# EasyEDA Pro project 慢上掉电自动化_2.eprj, schematic Schematic1

## Sheets
1 CTRL_MCU: Create Date: 2023-10-24; Page Name: CTRL_MCU; Project Name: 慢上掉电自动化_2; Schematic Name: Schematic1; Update Date: 2023-10-26; Company: 嘉立创EDA; Page Size: A4; Version: V1.0
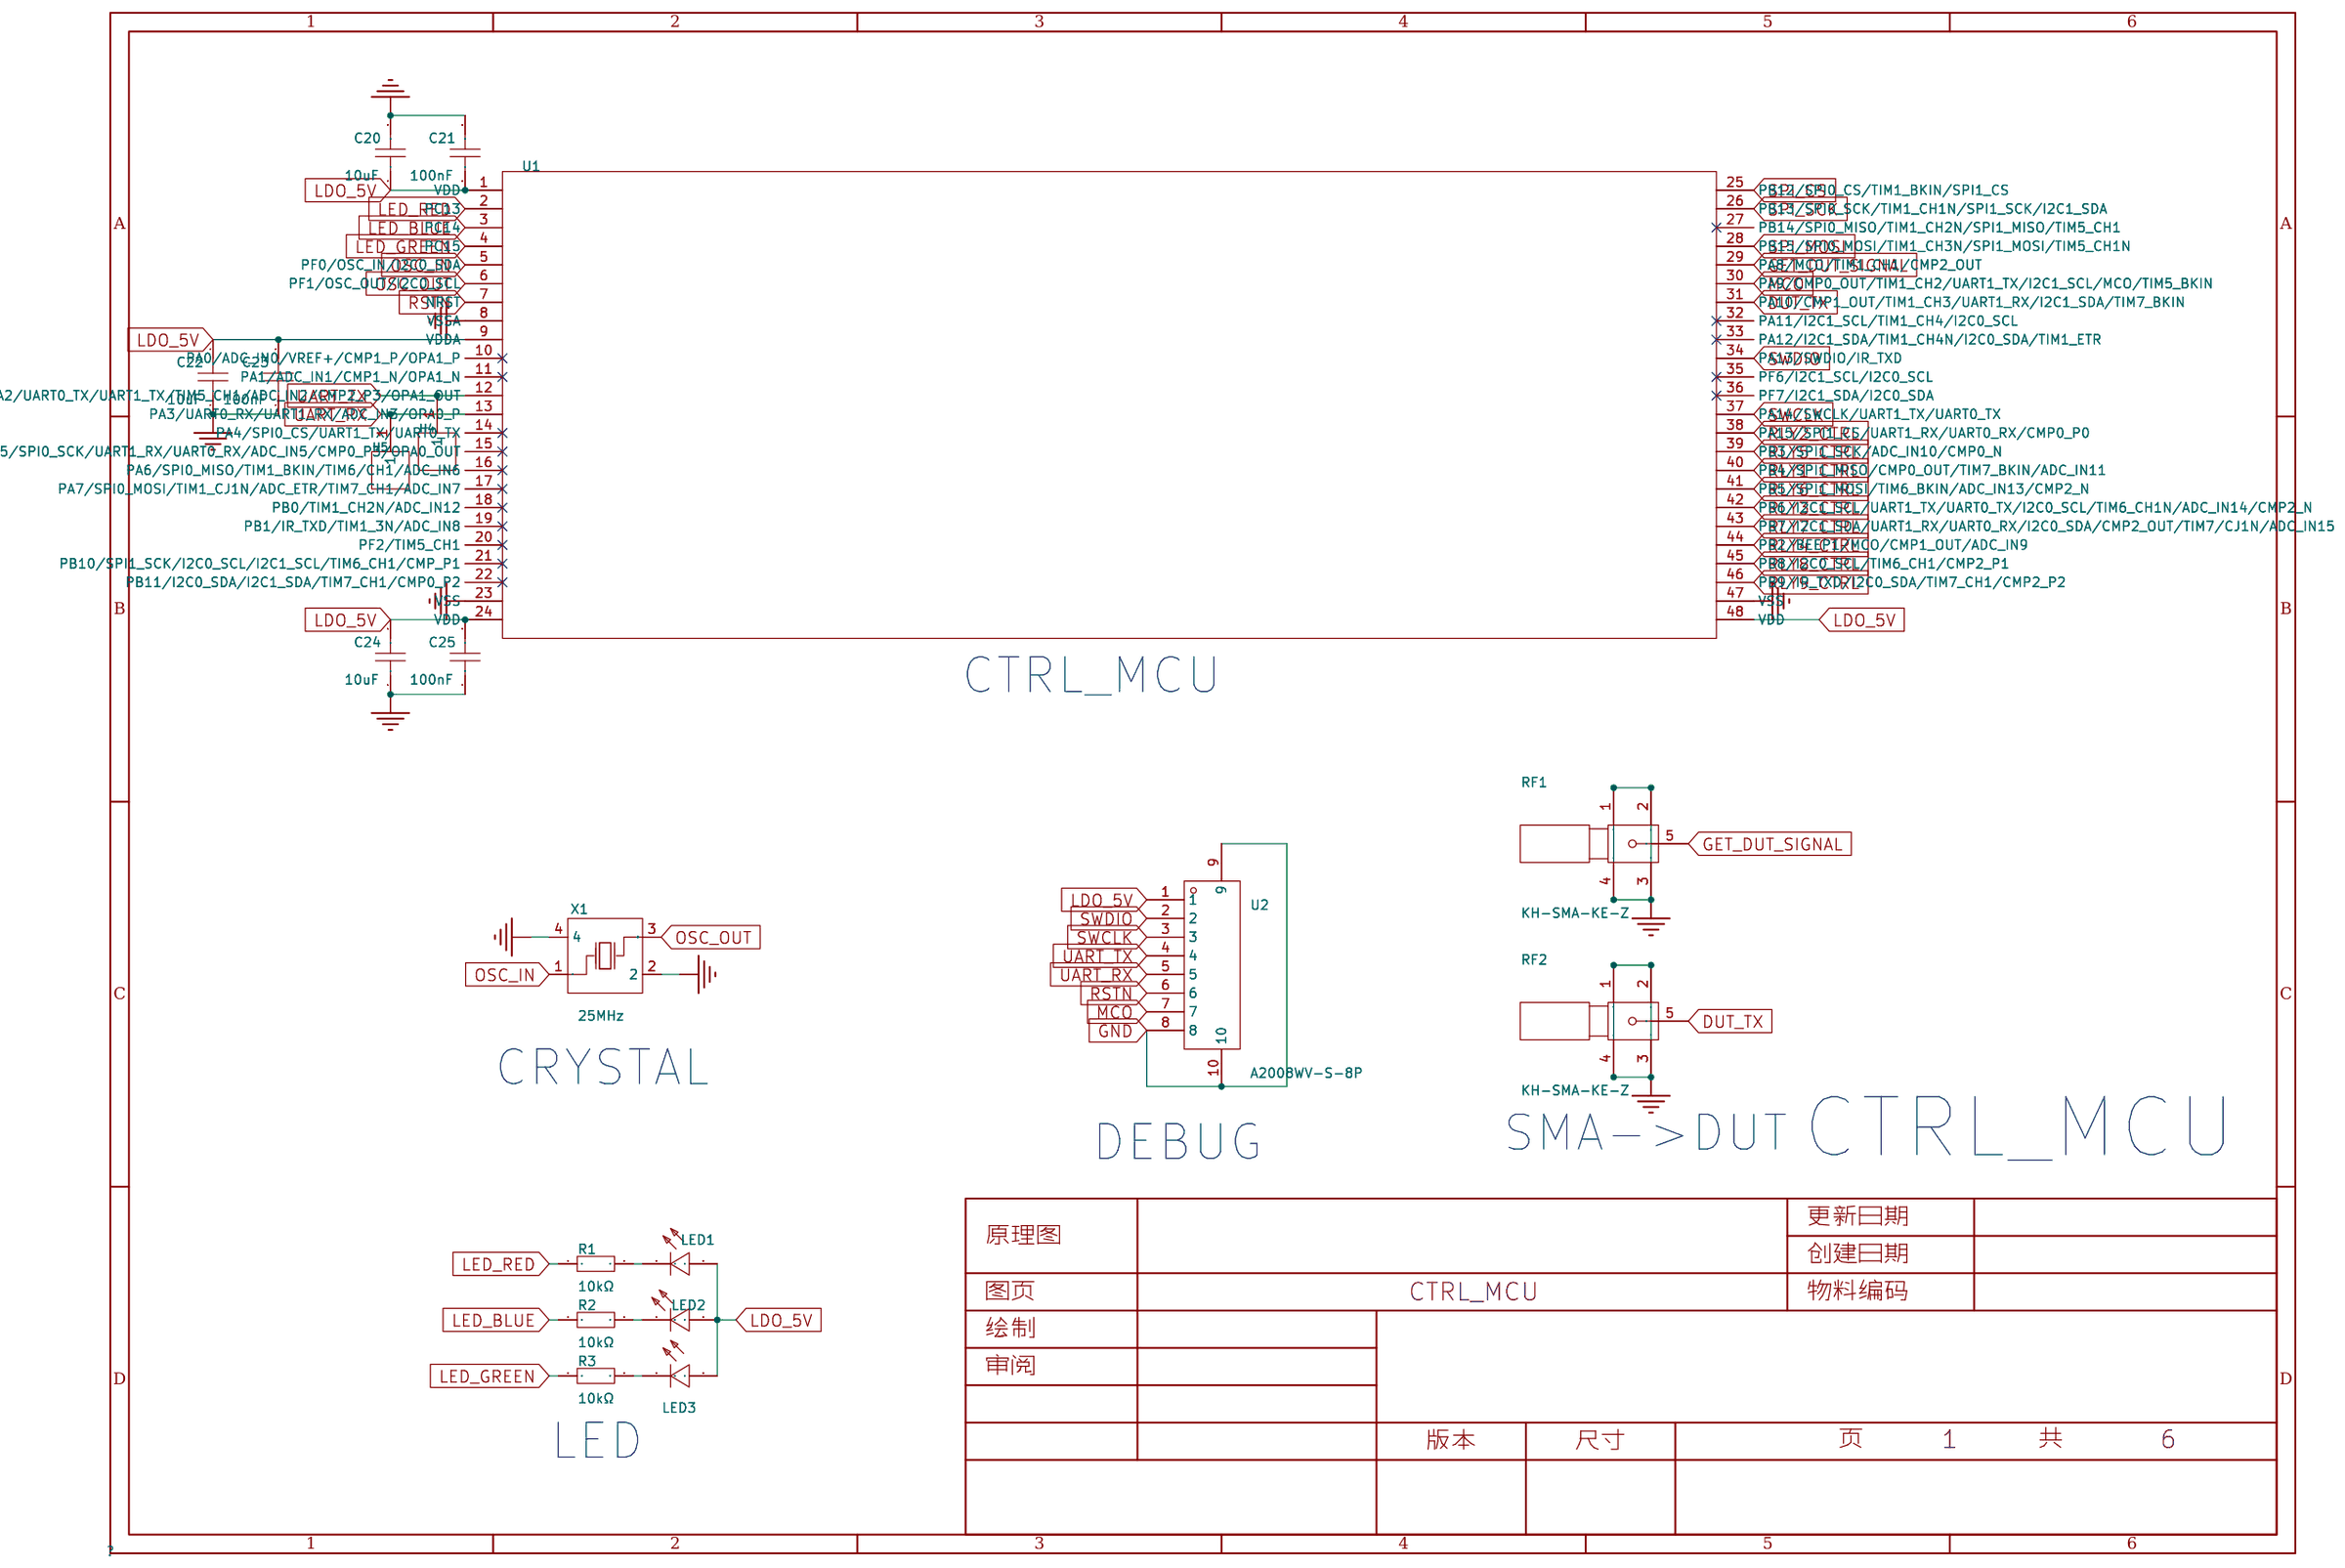
[diagram p0: CTRL_MCU]
2 POWER: Page Name: POWER; Update Date: 2023-10-25
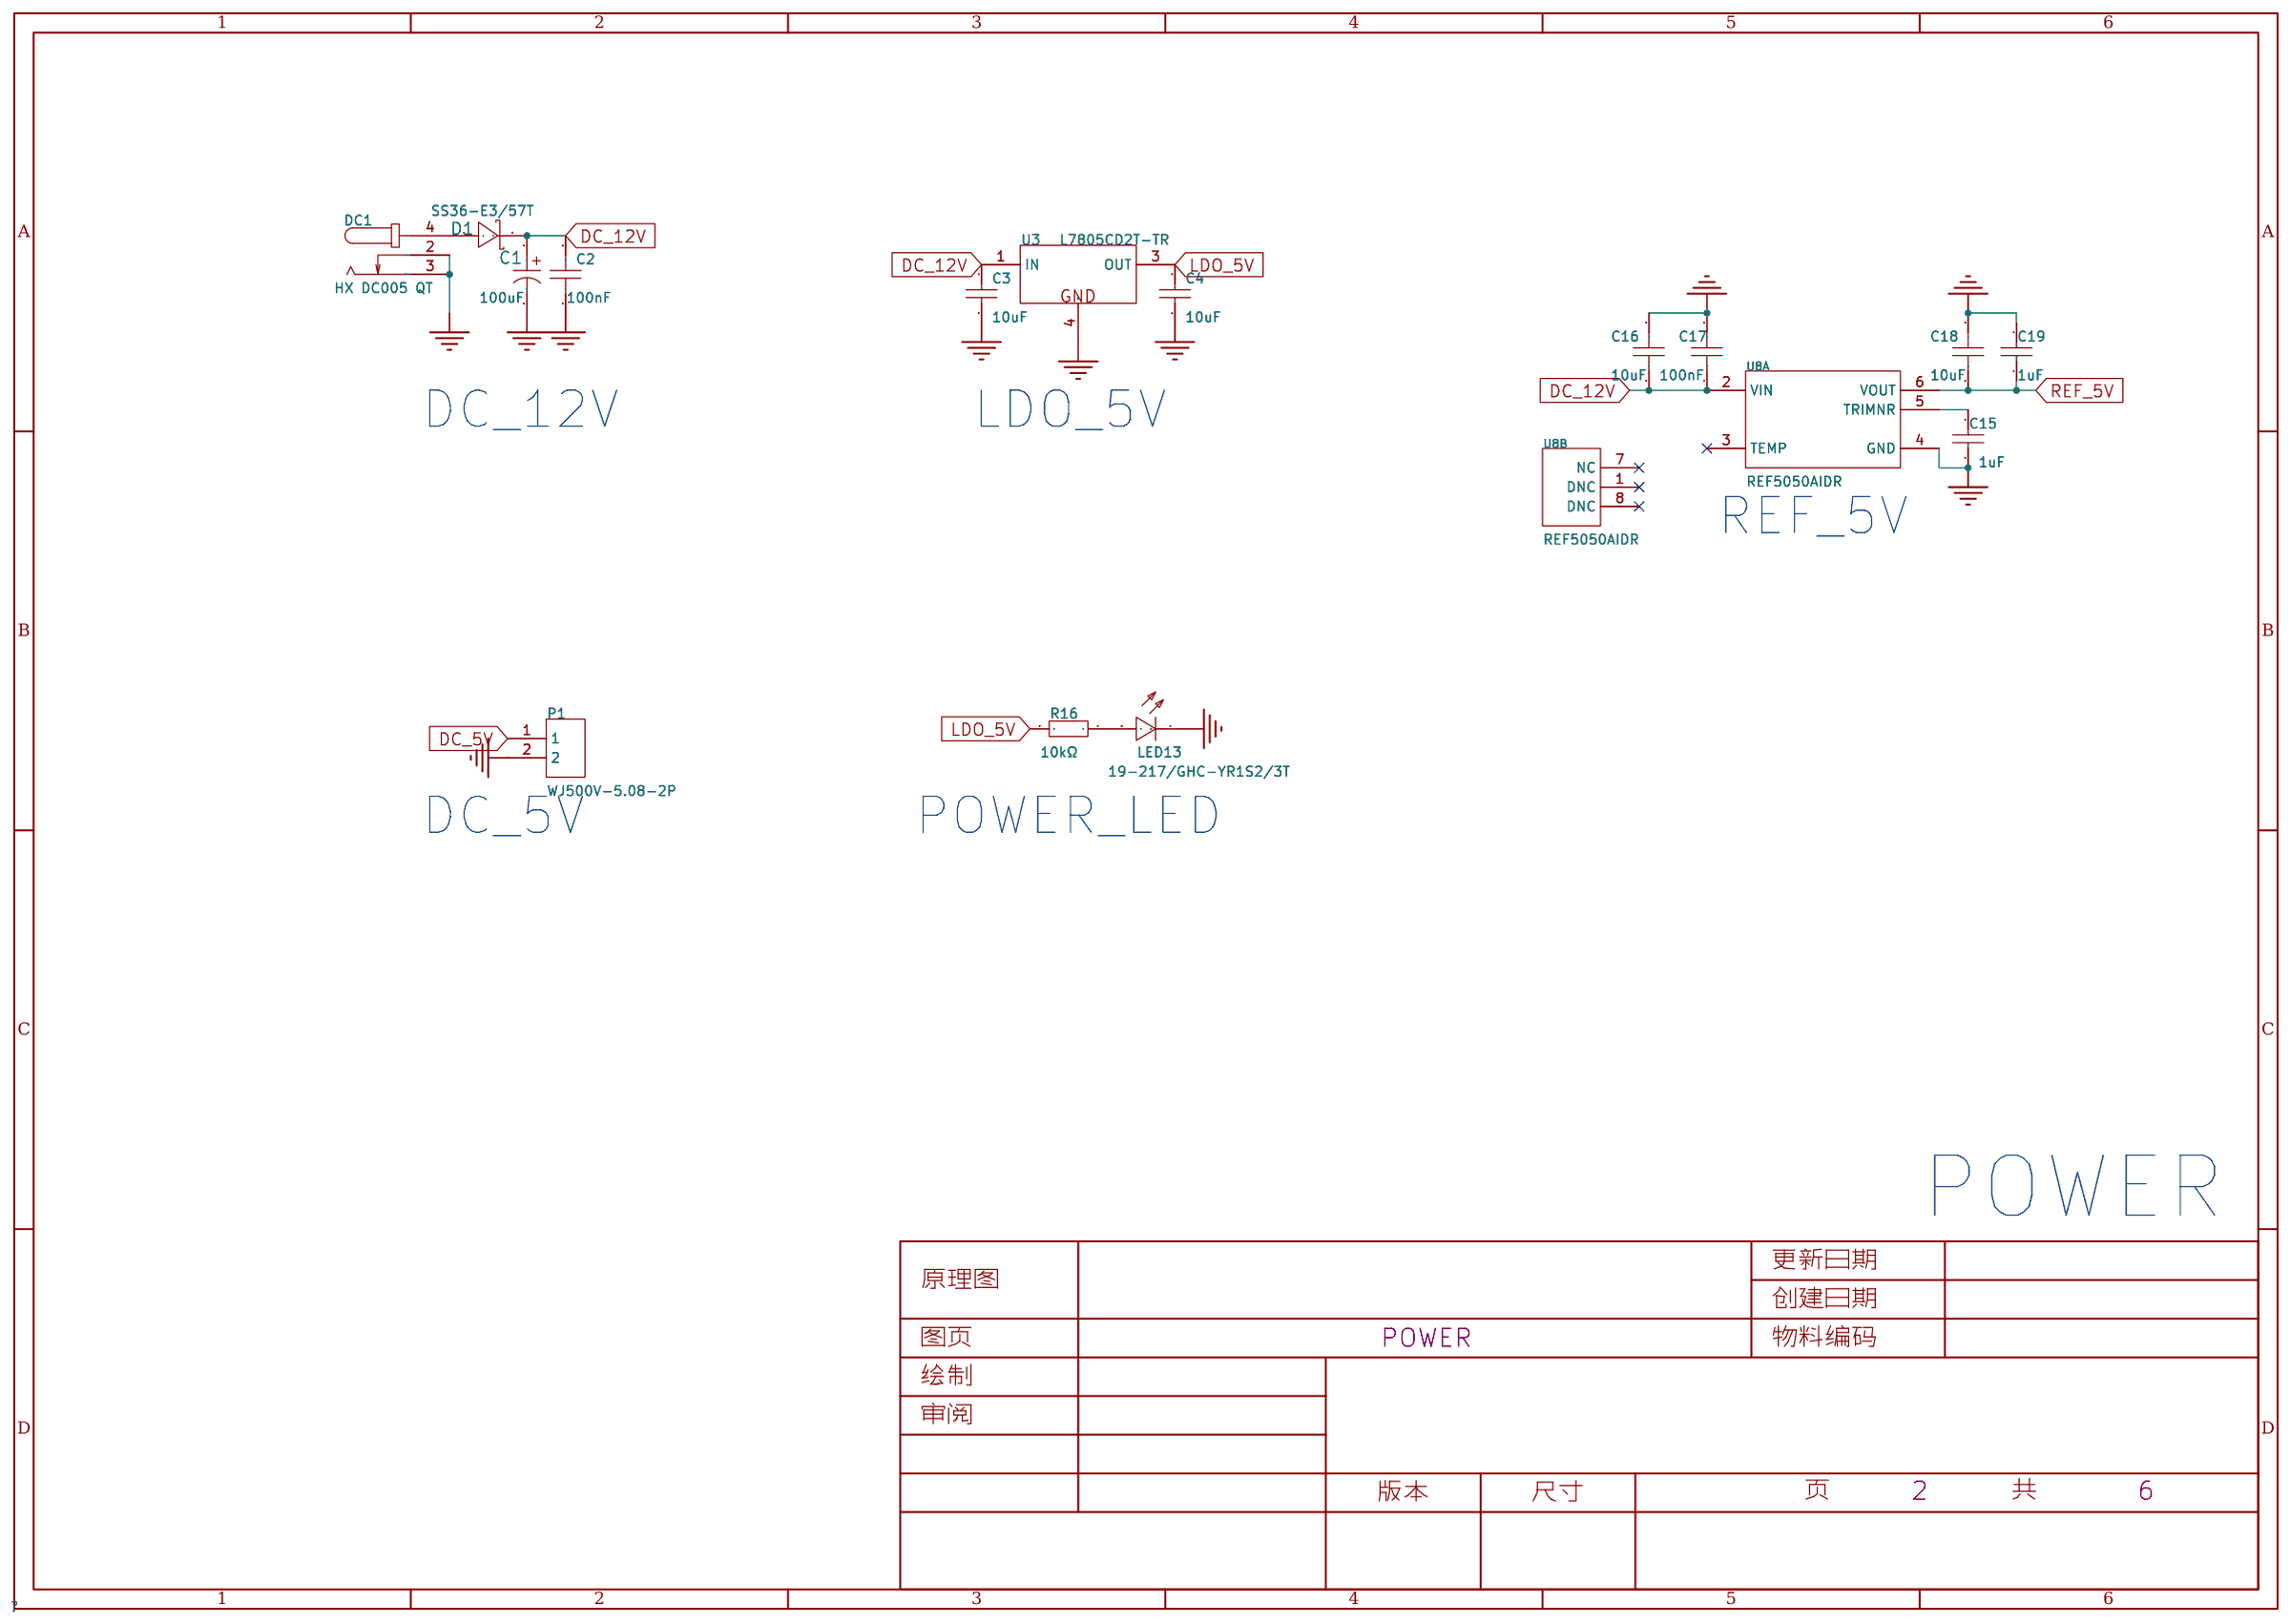
[diagram p1: POWER]
3 UART: Page Name: UART; Update Date: 2023-10-24
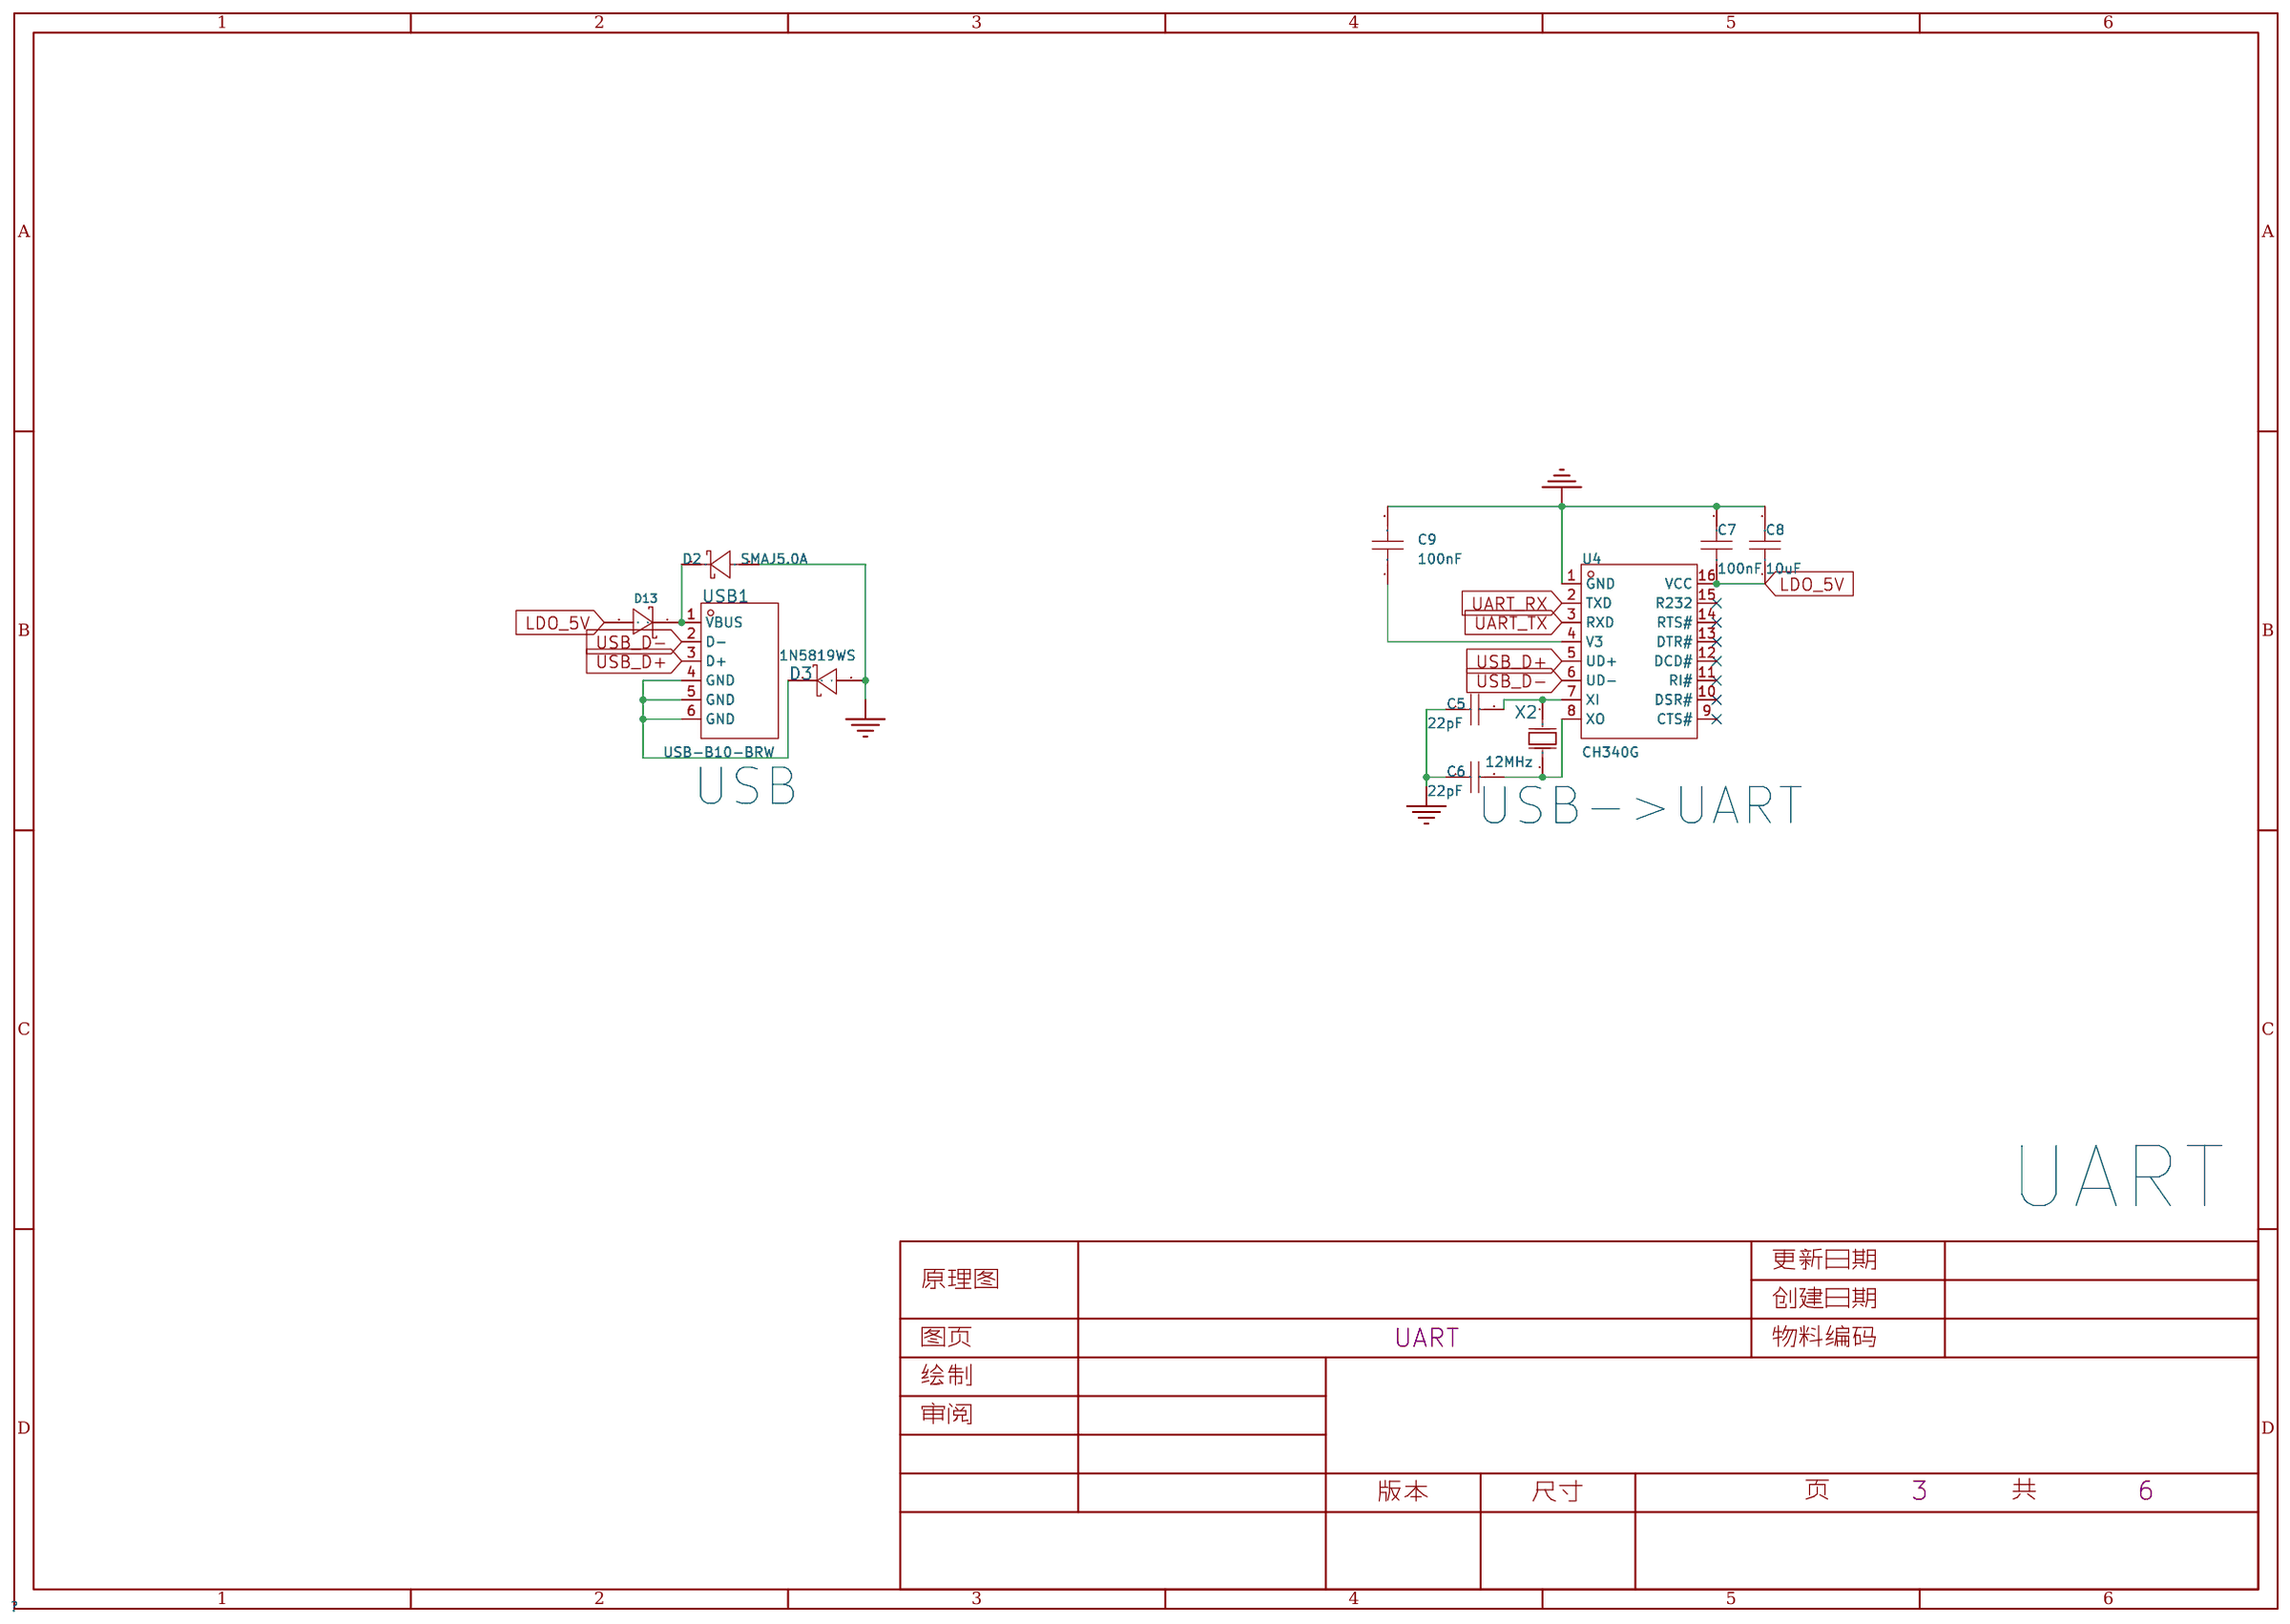
[diagram p2: UART]
4 螺孔: Page Name: 螺孔; Update Date: 2023-10-24
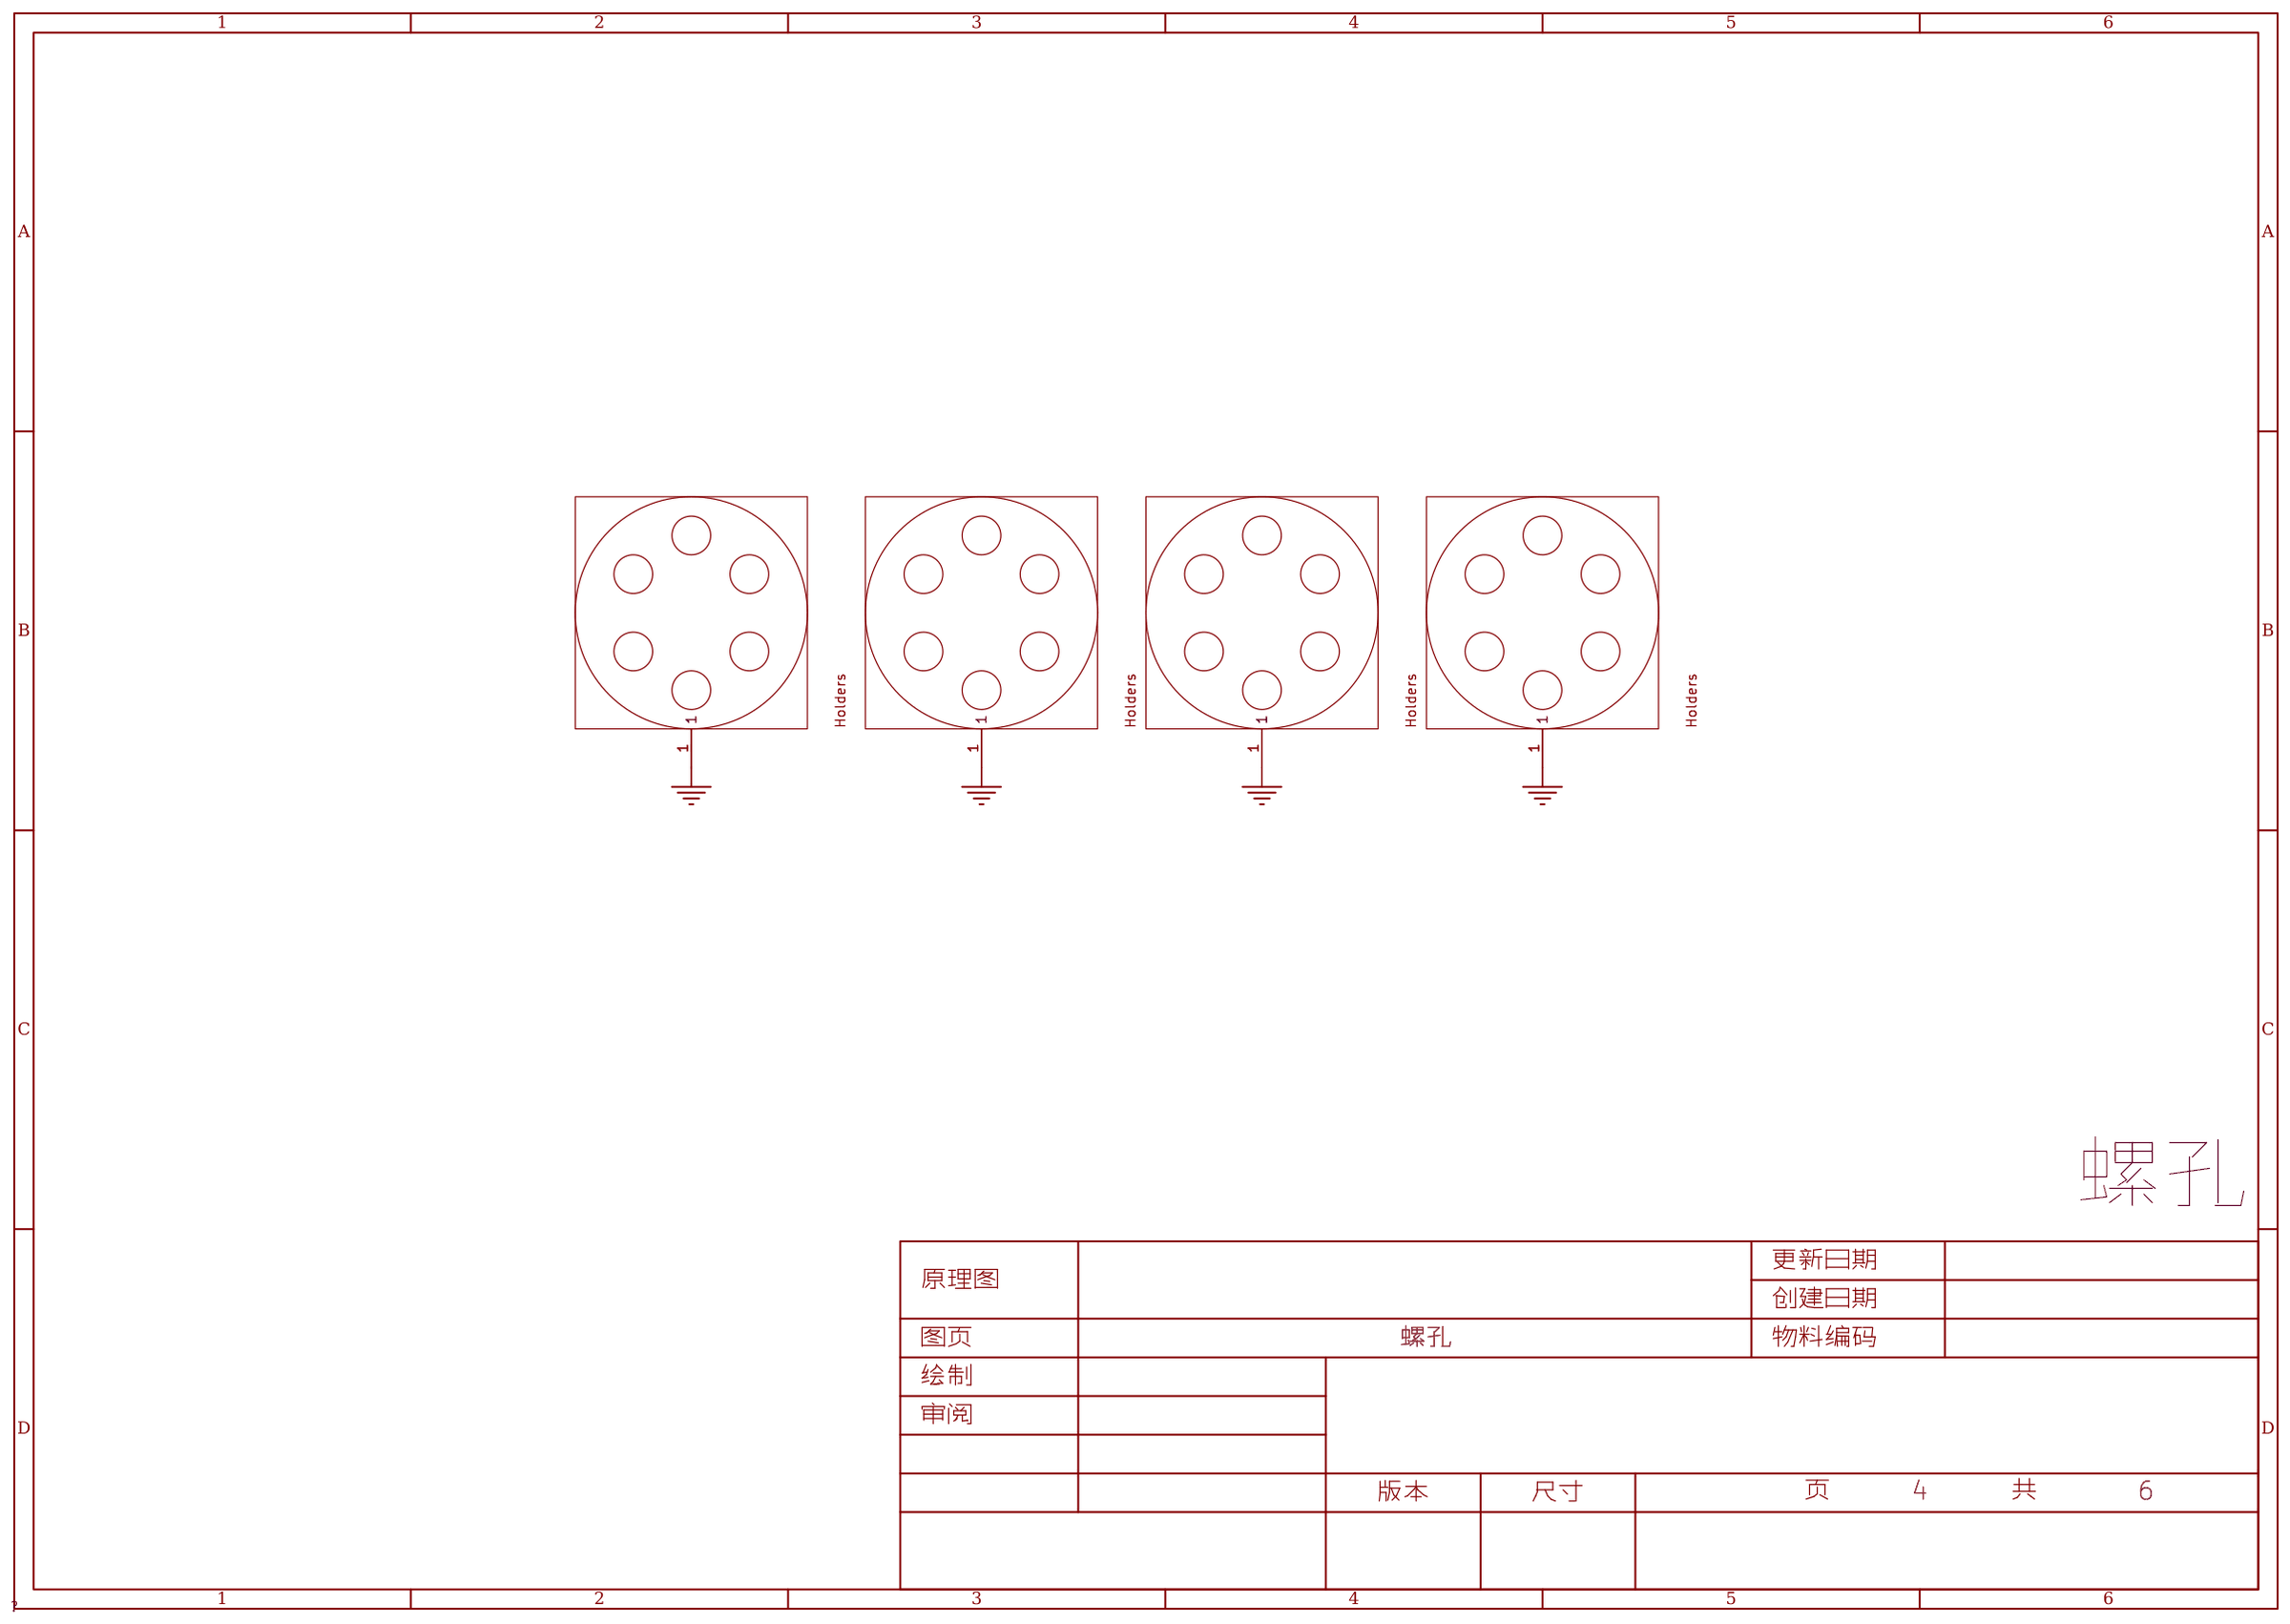
[diagram p3: 螺孔]
5 DAC: Page Name: DAC; Update Date: 2023-10-25
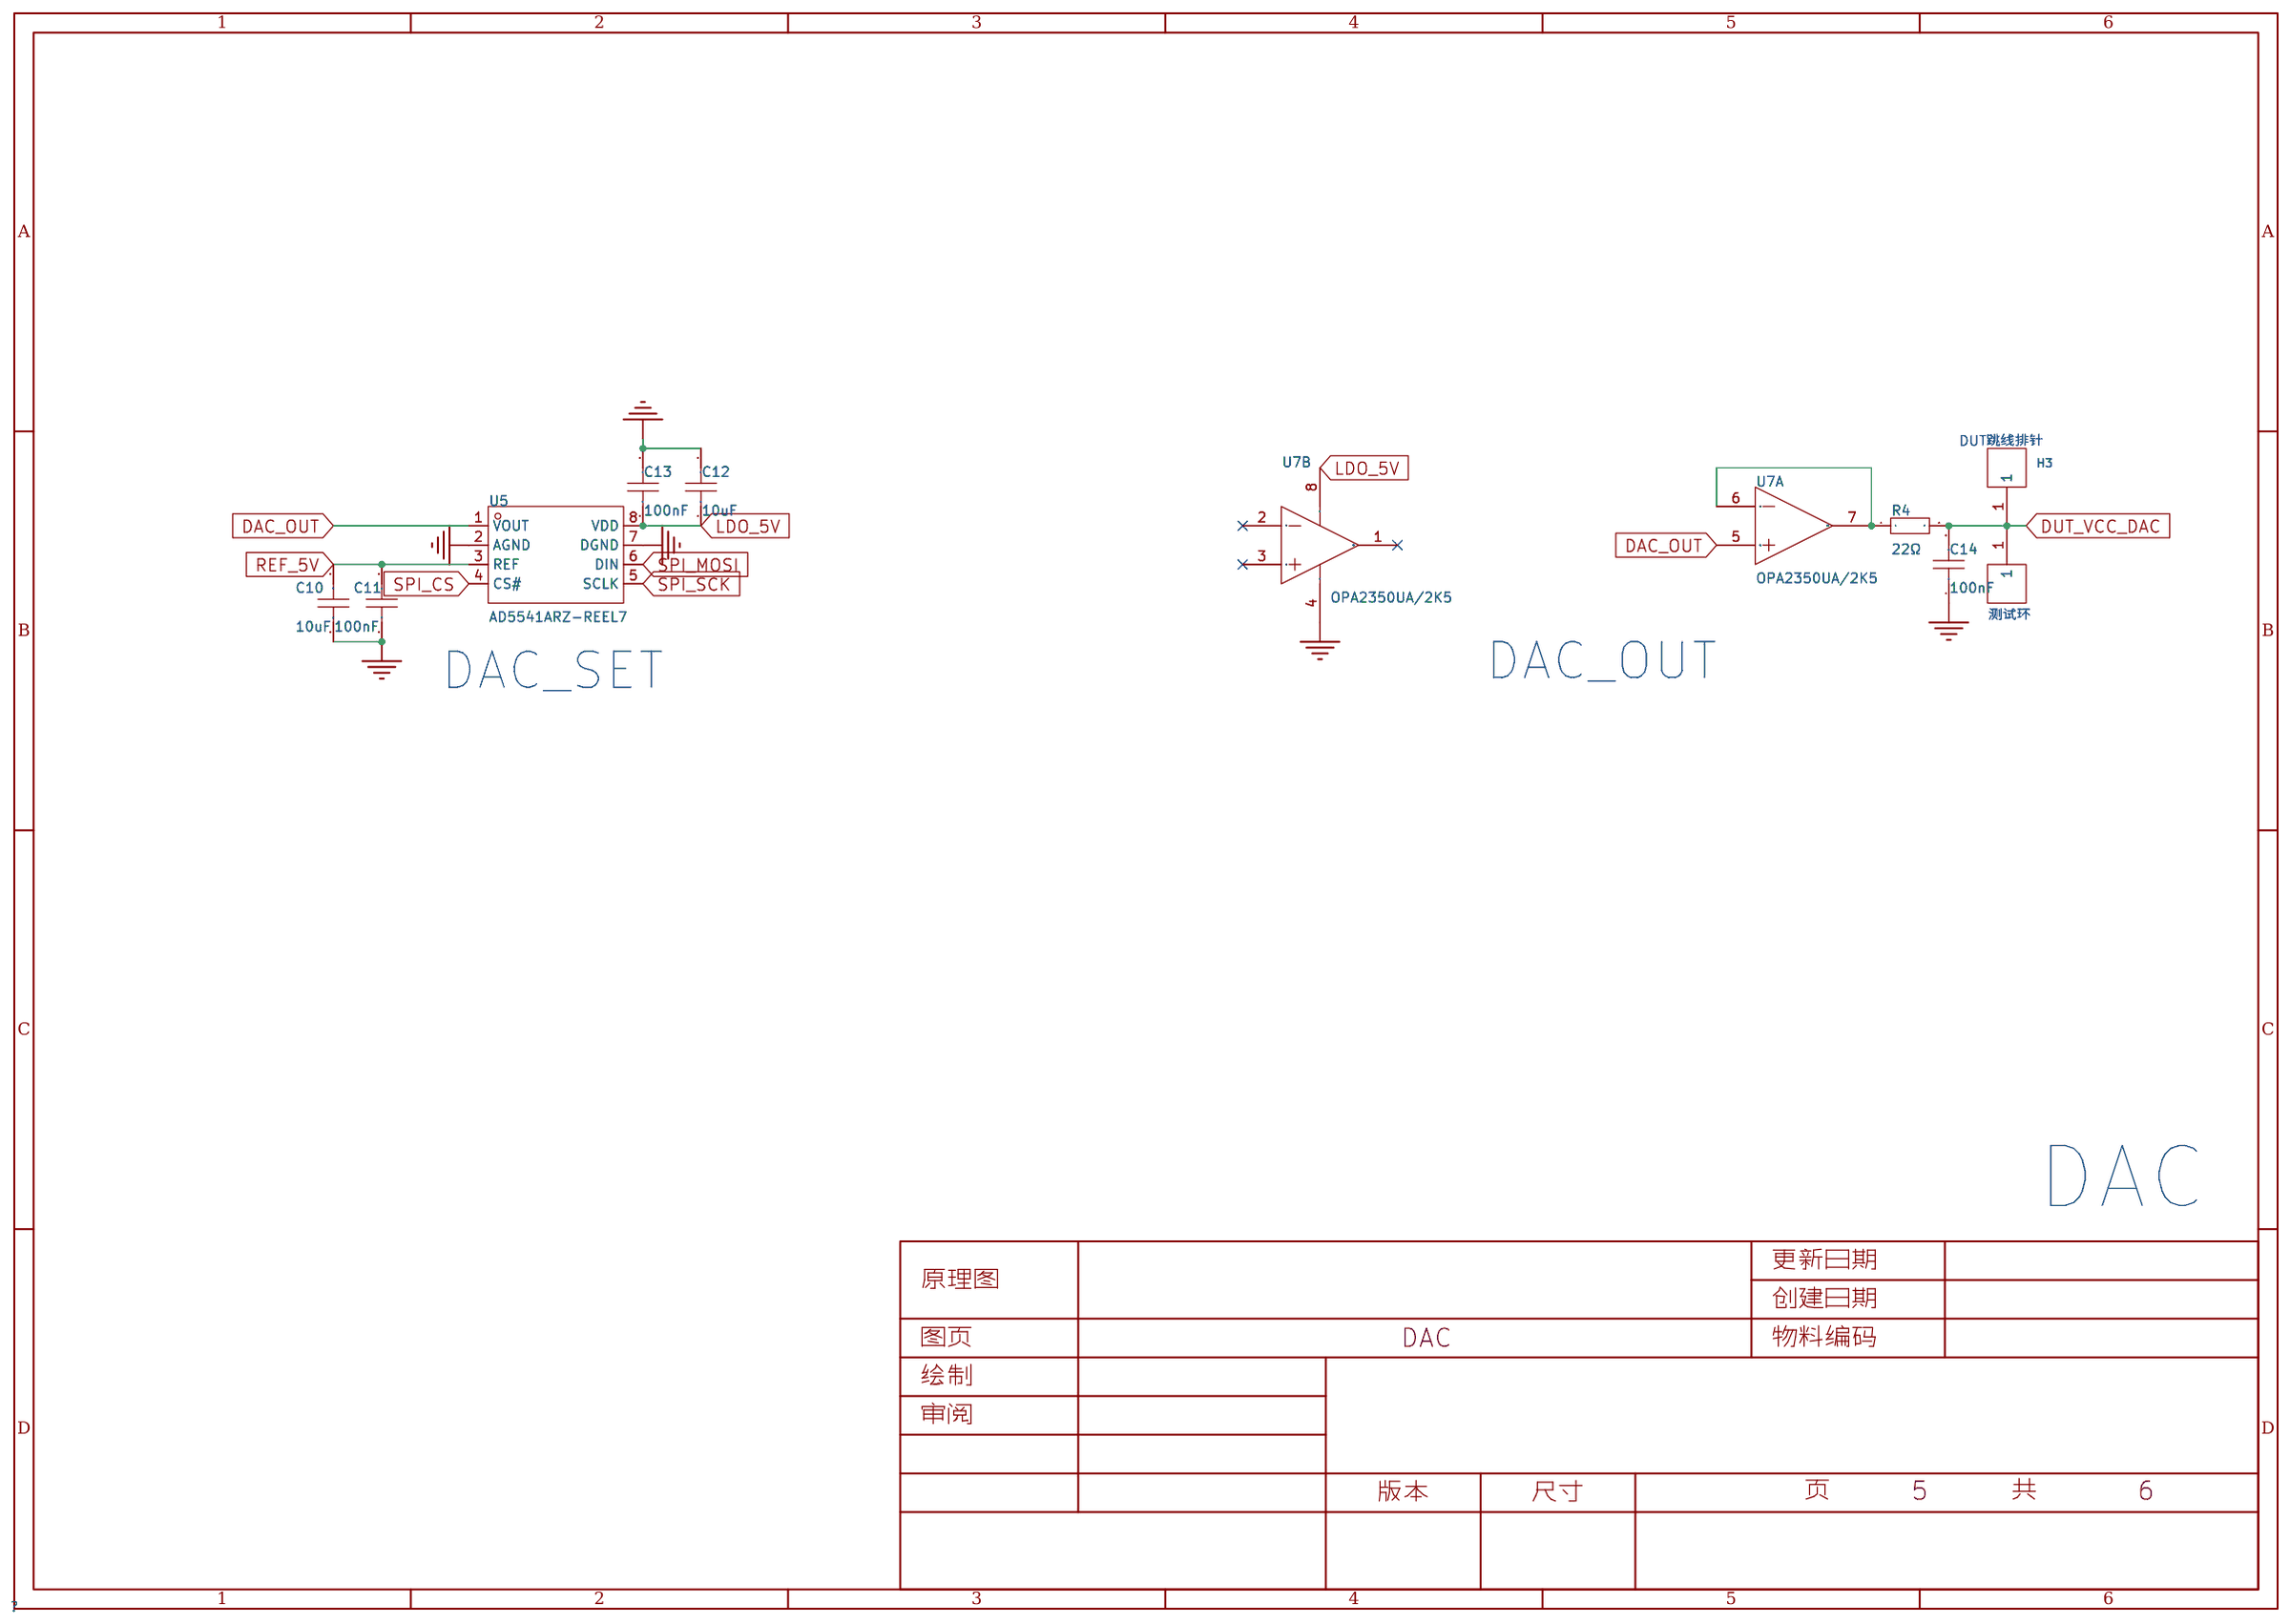
[diagram p4: DAC]
6 RLY: Page Name: RLY; Update Date: 2023-10-25
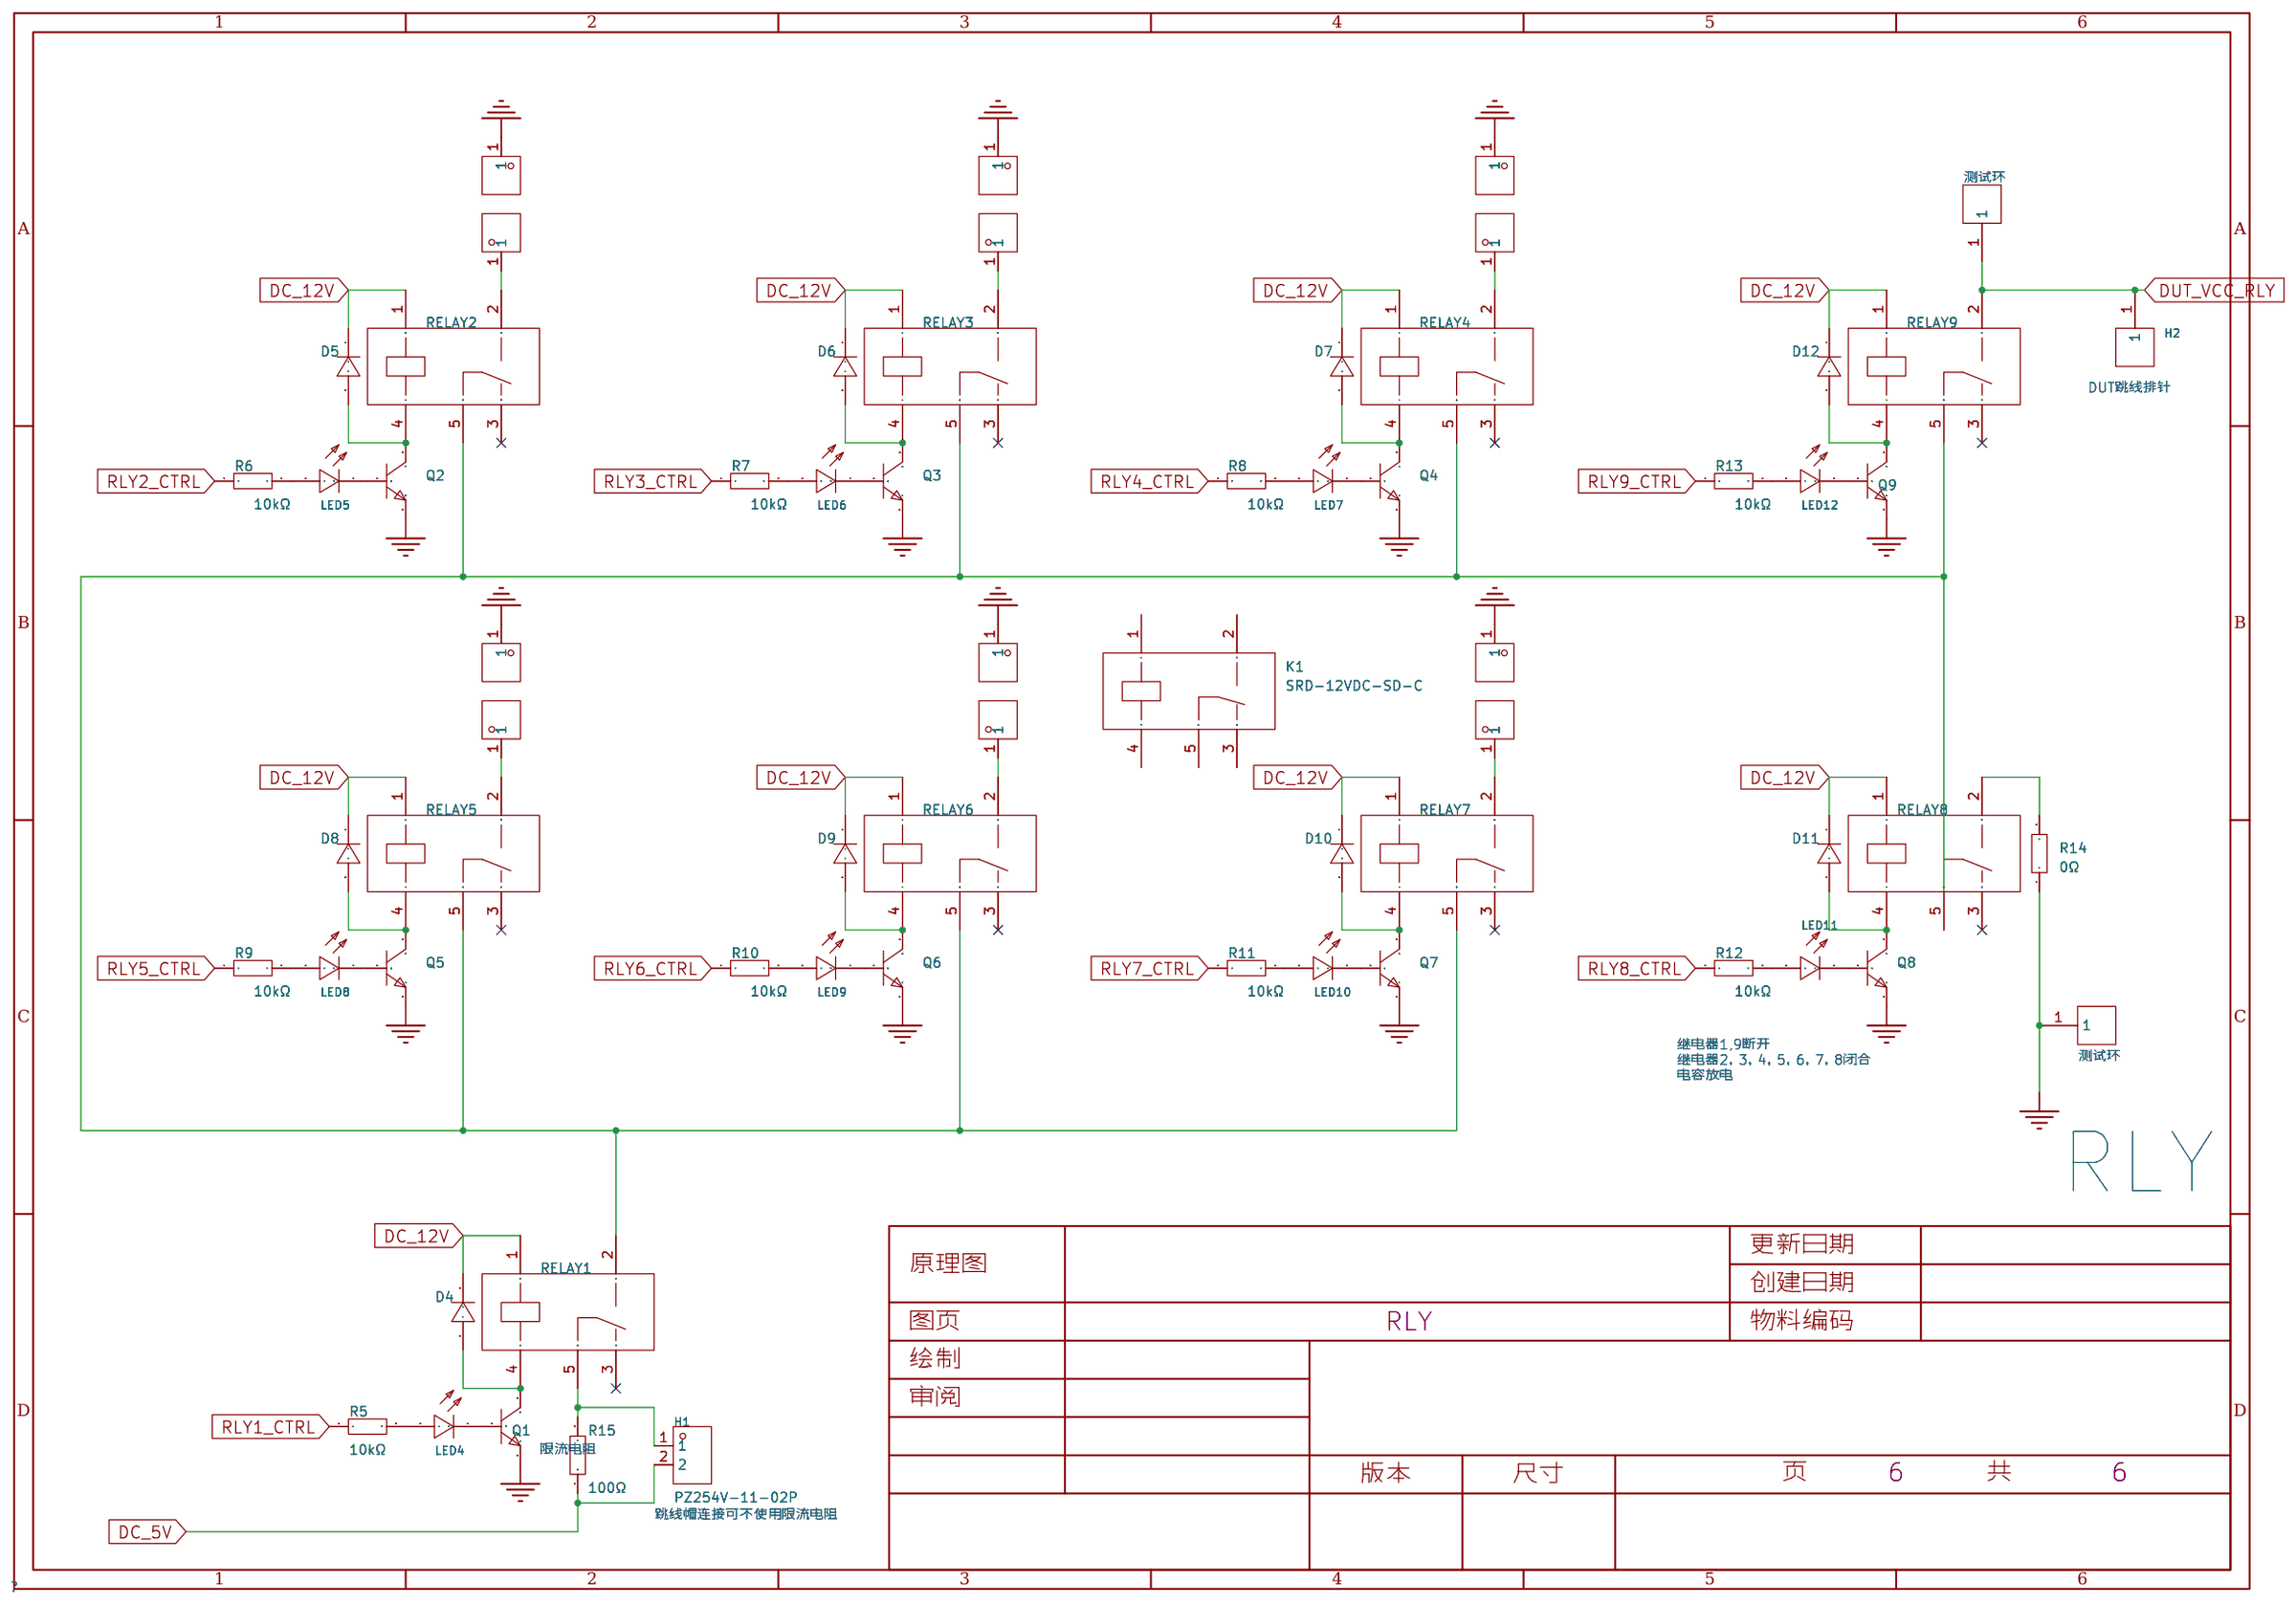
[diagram p5: RLY]

## Parts
sheet CTRL_MCU
C20  10uF  [C0603]
C21  100nF  [C0603]
C22  10uF  [C0603]
C23  100nF  [C0603]
C24  10uF  [C0603]
C25  100nF  [C0603]
H4  PZ254V-11-01P  [HDR-TH_1P-P2.54-V-M]
H5  PZ254V-11-01P  [HDR-TH_1P-P2.54-V-M]
LED1  NCD0603R1  [LED0603-RD_RED]
LED2  19-217/BHC-ZL1M2RY/3T  [LED0603-FD_BLUE]
LED3  19-217/GHC-YR1S2/3T  [LED0603-RD]
R1  10kΩ  [R0603]
R2  10kΩ  [R0603]
R3  10kΩ  [R0603]
RF1  KH-SMA-KE-Z  [SMA-TH_KH-SMA-KE-Z]
RF2  KH-SMA-KE-Z  [SMA-TH_KH-SMA-KE-Z]
U1  PT32A030C8T7  [LQFP-48_7.0X7.0X0.5P]
U2  A2008WV-S-8P  [CONN-SMD_A2008WV-S-8P]
X1  25MHz  [OSC-SMD_4P-L2.5-W2.0-BL]
sheet DAC
C10  10uF  [C0603]
C11  100nF  [C0603]
C12  10uF  [C0603]
C13  100nF  [C0603]
C14  100nF  [C0603]
H3  PZ254V-11-01P  [HDR-TH_1P-P2.54-V-M]
R4  22Ω  [R0603]
U5  AD5541ARZ-REEL7  [SOIC-8_L5.0-W4.0-P1.27-LS6.0-BL]
U7  OPA2350UA/2K5  [SOIC-8_L4.9-W3.9-P1.27-LS6.0-BL]  (sections 1,2)
U40  RH-5000  [TEST-TH_BD2.54-P1.4_RED]
sheet POWER
C1  100uF  [CAP-SMD_BD6.3-L6.6-W6.6-LS7.6-FD-1]
C2  100nF  [C0603]
C3  10uF  [C1206]
C4  10uF  [C1206]
C15  1uF  [C0603]
C16  10uF  [C0603]
C17  100nF  [C0603]
C18  10uF  [C0603]
C19  1uF  [C0603]
D1  SS36-E3/57T  [SMC_L7.1-W6.2-LS8.1-R-RD]
DC1  HX DC005 QT  [DC-IN-TH_HANXIA_HX-DC005-QT]
LED13  19-217/GHC-YR1S2/3T  [LED0603-RD]
P1  WJ500V-5.08-2P  [CONN-TH_2P-P5.00_WJ500V-5.08-2P]
R16  10kΩ  [R0603]
U3  L7805CD2T-TR  [TO-263-2_L10.0-W9.1-P5.08-LS15.2-TL]
U8  REF5050AIDR  [SOIC-8_L5.0-W4.0-P1.27-LS6.0-BL]  (sections 1,2)
sheet RLY
D4  1N4148WS  [SOD-323_L1.8-W1.3-LS2.5-RD]
D5  1N4148WS  [SOD-323_L1.8-W1.3-LS2.5-RD]
D6  1N4148WS  [SOD-323_L1.8-W1.3-LS2.5-RD]
D7  1N4148WS  [SOD-323_L1.8-W1.3-LS2.5-RD]
D8  1N4148WS  [SOD-323_L1.8-W1.3-LS2.5-RD]
D9  1N4148WS  [SOD-323_L1.8-W1.3-LS2.5-RD]
D10  1N4148WS  [SOD-323_L1.8-W1.3-LS2.5-RD]
D11  1N4148WS  [SOD-323_L1.8-W1.3-LS2.5-RD]
D12  1N4148WS  [SOD-323_L1.8-W1.3-LS2.5-RD]
H1  PZ254V-11-02P  [HDR-TH_2P-P2.54-V-M]
H2  PZ254V-11-01P  [HDR-TH_1P-P2.54-V-M]
K1  SRD-12VDC-SD-C  [RELAY-TH_SRD-XXVDC-SD-C]
LED4  19-217/GHC-YR1S2/3T  [LED0603-RD]
LED5  19-217/GHC-YR1S2/3T  [LED0603-RD]
LED6  19-217/GHC-YR1S2/3T  [LED0603-RD]
LED7  19-217/GHC-YR1S2/3T  [LED0603-RD]
LED8  19-217/GHC-YR1S2/3T  [LED0603-RD]
LED9  19-217/GHC-YR1S2/3T  [LED0603-RD]
LED10  19-217/GHC-YR1S2/3T  [LED0603-RD]
LED11  19-217/GHC-YR1S2/3T  [LED0603-RD]
LED12  19-217/GHC-YR1S2/3T  [LED0603-RD]
Q1  SS8050  [SOT-23-3_L2.9-W1.3-P1.90-LS2.4-BR]
Q2  SS8050  [SOT-23-3_L2.9-W1.3-P1.90-LS2.4-BR]
Q3  SS8050  [SOT-23-3_L2.9-W1.3-P1.90-LS2.4-BR]
Q4  SS8050  [SOT-23-3_L2.9-W1.3-P1.90-LS2.4-BR]
Q5  SS8050  [SOT-23-3_L2.9-W1.3-P1.90-LS2.4-BR]
Q6  SS8050  [SOT-23-3_L2.9-W1.3-P1.90-LS2.4-BR]
Q7  SS8050  [SOT-23-3_L2.9-W1.3-P1.90-LS2.4-BR]
Q8  SS8050  [SOT-23-3_L2.9-W1.3-P1.90-LS2.4-BR]
Q9  SS8050  [SOT-23-3_L2.9-W1.3-P1.90-LS2.4-BR]
R5  10kΩ  [R0603]
R6  10kΩ  [R0603]
R7  10kΩ  [R0603]
R8  10kΩ  [R0603]
R9  10kΩ  [R0603]
R10  10kΩ  [R0603]
R11  10kΩ  [R0603]
R12  10kΩ  [R0603]
R13  10kΩ  [R0603]
R14  0Ω  [R0603]
R15  100Ω  [R0603]
RELAY1  SRD-12VDC-SL-C  [RELAY-TH_SRD-XXVDC-XL-C]
RELAY2  SRD-12VDC-SL-C  [RELAY-TH_SRD-XXVDC-XL-C]
RELAY3  SRD-12VDC-SL-C  [RELAY-TH_SRD-XXVDC-XL-C]
RELAY4  SRD-12VDC-SL-C  [RELAY-TH_SRD-XXVDC-XL-C]
RELAY5  SRD-12VDC-SL-C  [RELAY-TH_SRD-XXVDC-XL-C]
RELAY6  SRD-12VDC-SL-C  [RELAY-TH_SRD-XXVDC-XL-C]
RELAY7  SRD-12VDC-SL-C  [RELAY-TH_SRD-XXVDC-XL-C]
RELAY8  SRD-12VDC-SL-C  [RELAY-TH_SRD-XXVDC-XL-C]
RELAY9  SRD-12VDC-SL-C  [RELAY-TH_SRD-XXVDC-XL-C]
U21  X5511FV-01-C30D97-0970  [HDR-TH_1P-V-F-1]
U27  X5511FV-01-C30D97-0970  [HDR-TH_1P-V-F-1]
U28  X5511FV-01-C30D97-0970  [HDR-TH_1P-V-F-1]
U29  X5511FV-01-C30D97-0970  [HDR-TH_1P-V-F-1]
U30  X5511FV-01-C30D97-0970  [HDR-TH_1P-V-F-1]
U31  X5511FV-01-C30D97-0970  [HDR-TH_1P-V-F-1]
U32  X5511FV-01-C30D97-0970  [HDR-TH_1P-V-F-1]
U33  X5511FV-01-C30D97-0970  [HDR-TH_1P-V-F-1]
U34  X5511FV-01-C30D97-0970  [HDR-TH_1P-V-F-1]
U35  X5511FV-01-C30D97-0970  [HDR-TH_1P-V-F-1]
U36  X5511FV-01-C30D97-0970  [HDR-TH_1P-V-F-1]
U37  X5511FV-01-C30D97-0970  [HDR-TH_1P-V-F-1]
U38  RH-5000  [TEST-TH_BD2.54-P1.4_RED]
U39  RH-5000  [TEST-TH_BD2.54-P1.4_RED]
sheet UART
C5  22pF  [C0603]
C6  22pF  [C0603]
C7  100nF  [C0603]
C8  10uF  [C0603]
C9  100nF  [C0603]
D2  SMAJ5.0A  [SMA_L4.3-W2.6-LS5.0-RD]
D3  1N5819WS  [SOD-323_L1.8-W1.3-LS2.5-RD]
D13  1N5819WS  [SOD-323_L1.8-W1.3-LS2.5-RD]
U4  CH340G  [SOIC-16_L9.9-W3.9-P1.27-LS6.0-BL]
USB1  USB-B10-BRW  [USB-B-TH_USB-B10-BRW]
X2  12MHz  [HC-49US_L11.5-W4.5-P4.88]
sheet 螺孔
J2  -  [DEMO板安装孔]
J3  -  [DEMO板安装孔]
J4  -  [DEMO板安装孔]
J5  -  [DEMO板安装孔]

## Library data of the parts
C10 C12 C16 C18 C20 C22 C24 = CL10A106MA8NRNC: 容值:10uF;精度:±20%;额定电压:25V;材质(温度系数):X5R;; LCSC Part Name: 10uF ±20% 25V; Supplier Part: C96446; Manufacturer: SAMSUNG(三星); Supplier Footprint: 0603; JLCPCB Part Class: Basic Part; Datasheet: https://atta.szlcsc.com/upload/public/pdf/source/20170325/1490427913016.pdf; Supplier: LCSC; Tolerance: ±20%; Voltage Rated: 25V; Temperature Coefficient: X5R
C7 C9 C11 C13 C14 C17 C21 C23 C25 = CC0603KRX7R9BB104: 容值:100nF;精度:±10%;额定电压:50V;材质(温度系数):X7R;; LCSC Part Name: 100nF ±10% 50V; Supplier Part: C14663; Manufacturer: YAGEO(国巨); Supplier Footprint: 0603; JLCPCB Part Class: Basic Part; Datasheet: https://atta.szlcsc.com/upload/public/pdf/source/20180910/C282072_33301C7F631E79921B82A8DAC6BCC5B3.pdf; Supplier: LCSC; Tolerance: ±10%; Voltage Rated: 50V; Temperature Coefficient: X7R
H2-H5 = PZ254V-11-01P: 排数:单排;总PIN位数:1P;间距:2.54mm;插针结构:1x1P;行距:-;安装类型:直插;圆针/方针:方针;额定电流:-;额定电压:-;配合针长度:6mm;塑高:2.5mm;端接针长度:3mm;触头材质:黄铜;触头镀层:-;工作温度范围:-40℃~+105℃;颜色:黑色;; LCSC Part Name: 2.54mm 1x1P 直插 方针; Supplier Part: C492400; Manufacturer: XFCN(兴飞); Supplier Footprint: 插件,P=2.54mm; JLCPCB Part Class: Extended Part; Datasheet: https://atta.szlcsc.com/upload/public/pdf/source/20200309/C492400_46876A5B545F5AE6B8D4A09C46E276E8.pdf; Supplier: LCSC; Number of Rows: 单排; Number of Pins: 1P; Pitch: 2.54mm; Pin Structure: 1x1P; Mounting Type: 直插; Circluar Pins/Square Pins: 方针; Length of Mating Pin: 6mm; Insulation Height: 2.5mm; Length of End Connection Pin: 3mm; Contact Material: 黄铜; Operating Temperature Range: -40℃~+105℃; Color: 黑色
LED1 = NCD0603R1_C84263: 发光颜色:红灯;; LCSC Part Name: 红灯; Supplier Part: C84263; Manufacturer: 国星光电; Supplier Footprint: 0603; JLCPCB Part Class: Extended Part; Datasheet: https://atta.szlcsc.com/upload/public/pdf/source/20200820/C84263_DABC6A75E58F576973B407FDBA283D60.pdf; Supplier: LCSC; Emitted Color: 红灯
LED2 = 19-217/BHC-ZL1M2RY/3T: 发光颜色:蓝灯;二极管配置:-;主波长:465nm~475nm;色温:-;功率:110mW;安装方式:-;; LCSC Part Name: 蓝灯; Supplier Part: C72041; Manufacturer: EVERLIGHT(亿光); Supplier Footprint: 0603; JLCPCB Part Class: Basic Part; Datasheet: https://atta.szlcsc.com/upload/public/pdf/source/20170116/1484561237273.pdf; Supplier: LCSC; Emitted Color: 蓝灯; Lens Color: 无色透明; Dominant Wavelength: 465nm~475nm; Peak Wavelength: 468nm; Forward Current: 5mA; Power Dissipation: 110mW; Viewing Angle: 120°; Operating Temperature: -40℃~+85℃
LED3-LED13 = 19-217/GHC-YR1S2/3T: 发光颜色:翠绿;二极管配置:-;主波长:520nm~535nm;色温:-;功率:110mW;安装方式:-;; LCSC Part Name: 翠绿; Supplier Part: C72043; Manufacturer: EVERLIGHT(亿光); Supplier Footprint: 0603; JLCPCB Part Class: Basic Part; Datasheet: https://atta.szlcsc.com/upload/public/pdf/source/20160507/1462613613780.pdf; Supplier: LCSC; Emitted Color: 翠绿; Lens Color: 无色透明; Dominant Wavelength: 520nm~535nm; Peak Wavelength: 518nm; Forward Current: 20mA; Power Dissipation: 110mW; Viewing Angle: 120°; Operating Temperature: -40℃~+85℃
R1-R3 R5-R13 R16 = 0603WAF1002T5E: 电阻类型:厚膜电阻;阻值:10kΩ;精度:±1%;功率:100mW;; LCSC Part Name: 厚膜电阻 10kΩ ±1% 100mW; Supplier Part: C25804; Manufacturer: UNI-ROYAL(厚声); Supplier Footprint: 0603; JLCPCB Part Class: Basic Part; Datasheet: https://atta.szlcsc.com/upload/public/pdf/source/20200306/C422600_1E6D84923E4A46A82E41ADD87F860B5C.pdf; Supplier: LCSC; Type: 厚膜电阻; Tolerance: ±1%; Power(Watts): 100mW; Temperature Coefficient: ±100ppm/℃; Overload Voltage (Max): 75V; Operating Temperature Range: -55℃~+155℃
RF1 RF2 = KH-SMA-KE-Z: 连接器类型:板端;射频系列:SMA;接口类型:内孔;端口数量:1;阻抗:-;频率-最大值:-;样式:正脚;接口直径:6.2mm;接口长度/高度:8mm;工作温度范围:-;; LCSC Part Name: SMA镀金半牙板端直插座子,H=8MM; Supplier Part: C504007; Manufacturer: kinghelm(金航标); Supplier Footprint: 插件; JLCPCB Part Class: Extended Part; Datasheet: https://atta.szlcsc.com/upload/public/pdf/source/20200330/C504007_C31FA59B5EDC95FA4ACB3324B1A20151.pdf; Supplier: LCSC; Connector Type: 板端; RF Series: SMA; Interface Type: 内孔; Number of Ports: 1; Sytle: 正脚; Interface Diameter: 6.2mm; Interface Length/Height: 8mm
U1 = PT32A030C8T7
U2 = A2008WV-S-8P: 参考系列:PH;间距:2mm;插针结构:1x8P;排数:1;每排PIN数:8;行距:-;安装方式:-;触头材质:黄铜;; LCSC Part Name: PH 2mm 1x8P 镀锡; Supplier Part: C273128; Manufacturer: CJT(长江连接器); Supplier Footprint: SMD,P=2mm; JLCPCB Part Class: Extended Part; Datasheet: https://atta.szlcsc.com/upload/public/pdf/source/20180913/C273128_BB1852F7672CD820F7AD4E26555E7BEC.pdf; Supplier: LCSC; Reference Series: PH; Pitch: 2mm; Pins Structure: 1x8P; Number of Rows: 1; Number of PINs Per Row: 8; Contact Material: 黄铜
X1 = ECS-250-10-36Q-AES-TR: 晶振类型:-;频率:25MHz;频率公差:±25ppm;频率稳定度:±50ppm;负载电容:10pF;等效串联电阻(ESR):60Ω;工作温度:-40℃~+125℃;; LCSC Part Name: 25MHz ±25ppm 10pF; Supplier Part: C435199; Manufacturer: ECS; Supplier Footprint: SMD2520-4P; JLCPCB Part Class: Extended Part; Datasheet: https://atta.szlcsc.com/upload/public/pdf/source/20200102/C435199_2BF86DF6FEC67718933C4FC174F98801.pdf; Supplier: LCSC; Frequency Tolerance: ±25ppm; Frequency Stability: ±50ppm; Load Capacitance: 10pF; Equivalent Series Resistance (ESR): 60Ω; Operating Temperature: -40℃~+125℃
R4 = 0603WAF220JT5E: 电阻类型:厚膜电阻;阻值:22Ω;精度:±1%;功率:100mW;; LCSC Part Name: 22Ω ±1% 100mW; Supplier Part: C23345; Manufacturer: UNI-ROYAL(厚声); Supplier Footprint: 0603; JLCPCB Part Class: Basic Part; Datasheet: https://atta.szlcsc.com/upload/public/pdf/source/20200306/C422600_1E6D84923E4A46A82E41ADD87F860B5C.pdf; Supplier: LCSC; Type: 厚膜电阻; Tolerance: ±1%; Power(Watts): 100mW; Temperature Coefficient: ±100ppm/℃; Overload Voltage (Max): 75V; Operating Temperature Range: -55℃~+155℃
U5 = AD5541ARZ-REEL7: D/A 位数:-;D/A通道数:-;输出类型:-;读写接口类型:-;; Supplier Part: C967393; Manufacturer: ADI(亚德诺)/LINEAR; Supplier Footprint: SOIC-8; JLCPCB Part Class: Extended Part; Datasheet: https://atta.szlcsc.com/upload/public/pdf/source/20200720/C649795_5D512B206C8637CEAE7C18B6DAEE7C2A.pdf; Supplier: LCSC
U7 = OPA2350UA/2K5: 放大器组数:2;输入偏置电流(Ib):0.5pA;增益带宽积(GBP):38MHz;压摆率(SR):22V/us;轨到轨:轨到轨;; Supplier Part: C55904; Manufacturer: TI(德州仪器); Supplier Footprint: SOP-8; JLCPCB Part Class: Extended Part; Datasheet: https://www.ti.com/cn/lit/gpn/opa2350; Supplier: LCSC; Number of Circuits: 2; Current - Input Bias(Ib): 0.5pA; Gain Bandwidth Product(GBP): 38MHz; Slew Rate(SR): 22V/us; Rail to Rail: 轨到轨; Output Current: 40mA; Supply Voltage: 2.5V~5.5V; Supply Current: 5.2mA; Operating Temperature: -40℃~+85℃
U38-U40 = RH-5000: 100x80mm; LCSC Part Name: PCB电路板测试点/测试针; Supplier Part: C5277086; Manufacturer: 荣和; JLCPCB Part Class: Extended Part; Datasheet: https://atta.szlcsc.com/upload/public/pdf/source/20230704/1671C2774A3D6CEDC1FD6AAF48538C87.pdf; Supplier: LCSC
C1 = RVE100UF35V67RV0072: 容值:100uF;精度:±20%;额定电压:35V;纹波电流:230mA@120Hz;等效串联电阻:600mΩ@100kHz;; LCSC Part Name: 100uF ±20% 35V; Supplier Part: C2836437; Manufacturer: KNSCHA(科尼盛); Supplier Footprint: SMD,D6.3xL7.7mm; JLCPCB Part Class: Extended Part; Datasheet: https://atta.szlcsc.com/upload/public/pdf/source/20220719/B52EB46F8A1558448ED03D8B4CB3C24F.pdf; Supplier: LCSC; Tolerance: ±20%; Rated Voltage: 35V; φD: 6.3mm; L: 7.7mm; Ripple Current: 230mA@120Hz; Equivalent Series Resistance(ESR): 600mΩ@100kHz; Lifetime @ Temp: 2000hrs@105℃; Operating Temperature: -55℃~+105℃
C2 = CL10B104KB8NNNC: 容值:100nF;精度:±10%;额定电压:50V;材质(温度系数):X7R;; LCSC Part Name: 100nF ±10% 50V; Supplier Part: C1591; Manufacturer: SAMSUNG(三星); Supplier Footprint: 0603; JLCPCB Part Class: Extended Part; Datasheet: https://atta.szlcsc.com/upload/public/pdf/source/20160103/1457707680512.pdf; Supplier: LCSC; Tolerance: ±10%; Voltage Rated: 50V; Temperature Coefficient: X7R
C3 C4 = CL31A106KBHNNNE: 容值:10uF;精度:±10%;额定电压:50V;材质(温度系数):X5R;; LCSC Part Name: 10uF ±10% 50V; Supplier Part: C13585; Manufacturer: SAMSUNG(三星); Supplier Footprint: 1206; JLCPCB Part Class: Basic Part; Datasheet: https://atta.szlcsc.com/upload/public/pdf/source/20160103/1457707668742.pdf; Supplier: LCSC; Tolerance: ±10%; Voltage Rated: 50V; Temperature Coefficient: X5R
C15 C19 = CL10A105KB8NNNC: 容值:1uF;精度:±10%;额定电压:50V;材质(温度系数):X5R;; LCSC Part Name: 1uF ±10% 50V; Supplier Part: C15849; Manufacturer: SAMSUNG(三星); Supplier Footprint: 0603; JLCPCB Part Class: Basic Part; Datasheet: https://atta.szlcsc.com/upload/public/pdf/source/20160103/1457707679084.pdf; Supplier: LCSC; Tolerance: ±10%; Voltage Rated: 50V; Temperature Coefficient: X5R
D1 = SS36-E3/57T: 直流反向耐压（Vr）:60V;平均整流电流（Io）:3A;正向压降（Vf）:750mV @ 3A;; Supplier Part: C35722; Manufacturer: VISHAY(威世); Supplier Footprint: SMC(DO-214AB); JLCPCB Part Class: Basic Part; Supplier: LCSC
DC1 = HX DC005 QT: 连接器类型:DC插座;安装方式:卧插;额定电流:1A;额定电压:12V;工作温度范围:-25℃~+85℃;; LCSC Part Name: DC插座; Supplier Part: C5184829; Manufacturer: hanxia(韩下); Supplier Footprint: 插件; JLCPCB Part Class: Extended Part; Datasheet: https://atta.szlcsc.com/upload/public/pdf/source/20220930/72F2DABD42189BF434FA6ABB0C092A1C.pdf; Supplier: LCSC; Connector Type: DC插座; Mounting Style: 卧插; Current Rating (Max): 1A; Voltage Rating (Max): 12V; Operating Temperature Range: -25℃~+85℃
P1 = WJ500V-5.08-2P: 间距:5.08mm;结构:1x2P;排数:1;每排PIN数:2;安装方式:直针;额定电流:18A;额定电压:250V;线规 - AWG:14~30;线规 - mm2:2.5;工作温度范围:-40℃~+105℃;颜色:绿色;; LCSC Part Name: 5.08mm 1x2P 排数:1 每排P数:2 直针 可拼接; Supplier Part: C8465; Manufacturer: KANGNEX(康奈克斯电气); Supplier Footprint: 插件,P=5.08mm; JLCPCB Part Class: Extended Part; Datasheet: https://atta.szlcsc.com/upload/public/pdf/source/20191225/C8465_02D34CE5B5B4A53DF5891601D97FA9F4.pdf; Supplier: LCSC; Pitch: 5.08mm; Structure: 1x2P; Number of Rows: 1; Number of PINs Per Row: 2; Mounting Style: 直针; Current Rating (Max): 18A; Voltage Rating (Max): 250V; Wire Gauge - AWG: 14~30; Wire Gauge - mm2: 2.5; Operating Temperature Range: -40℃~+105℃; Color: 绿色; Number of Pins: 2P
U3 = L7805CD2T-TR: 输出类型:固定;输出极性:正;最大输入电压:35V;输出电压:5V;输出电流:1.5A;电源纹波抑制比(PSRR):62dB@(120Hz);; LCSC Part Name: 输入35V 输出5V 1.5A; Supplier Part: C15077; Manufacturer: ST(意法半导体); Supplier Footprint: TO-263; JLCPCB Part Class: Extended Part; Datasheet: https://atta.szlcsc.com/upload/public/pdf/source/20191219/C472632_C0855675BBC73B8C8E44EE1325AAD56A.pdf; Supplier: LCSC; Output Type: 固定; Output Polarity: 正; Number of Outputs: 1; Maximum Input Voltage: 35V; Output Voltage: 5V; Dropout Voltage: 2V@(1A); Output Current: 1.5A; Power Supply Rejection Ratio (PSRR): 62dB@(120Hz)
U8 = REF5050AIDR: 输出类型:固定;输入电压:5.2V~18V;输出电压:5V;输出电流:10mA;精度:±0.1%;; Supplier Part: C27804; Manufacturer: TI(德州仪器); Supplier Footprint: SOIC-8; JLCPCB Part Class: Extended Part; Datasheet: https://www.ti.com/cn/lit/gpn/ref5050; Supplier: LCSC; Reference Type: 串联; Output Type: 固定; Input Voltage: 5.2V~18V; Output Voltage: 5V; Output Current: 10mA; Tolerance: ±0.1%; Temperature Coefficient: 8ppm/℃; Supply Current: 1.2mA; Operating Temperature: -40℃~+125℃@(Ta)
D4-D12 = 1N4148WS_C2128: 二极管配置:独立式;功率:200mW;直流反向耐压(Vr):100V;平均整流电流(Io):150mA;正向压降(Vf):1.25V@150mA;反向恢复时间(trr):4ns;; LCSC Part Name: 电压:100V 电流:150mA T4; Supplier Part: C2128; Manufacturer: CJ(江苏长电/长晶); Supplier Footprint: SOD-323; JLCPCB Part Class: Basic Part; Datasheet: https://atta.szlcsc.com/upload/public/pdf/source/20140809/1457707208178.pdf; Supplier: LCSC; Diode Configuration: 独立式; Power Dissipation: 200mW; Reverse Voltage (Vr): 100V; Average Rectified Current (Io): 150mA; Forward Voltage (Vf@If): 1.25V@150mA; Reverse Leakage Current: 1uA@75V; Reverse Recovery Time (trr): 4ns; Operating Temperature: +150℃@(Tj)
H1 = PZ254V-11-02P: 排数:单排;总PIN位数:2P;间距:2.54mm;插针结构:1x2P;行距:-;安装类型:直插;圆针/方针:方针;额定电流:-;额定电压:-;配合针长度:6mm;塑高:2.5mm;端接针长度:3mm;触头材质:黄铜;触头镀层:-;工作温度范围:-40℃~+105℃;颜色:黑色;; LCSC Part Name: 2.54mm 1x2P 直插 方针; Supplier Part: C492401; Manufacturer: XFCN(兴飞); Supplier Footprint: 插件,P=2.54mm; JLCPCB Part Class: Extended Part; Datasheet: https://atta.szlcsc.com/upload/public/pdf/source/20200309/C492401_A812433581A9B211A7FFA413ADDFF0E5.pdf; Supplier: LCSC; Number of Rows: 单排; Number of Pins: 2P; Pitch: 2.54mm; Pin Structure: 1x2P; Mounting Type: 直插; Circluar Pins/Square Pins: 方针; Length of Mating Pin: 6mm; Insulation Height: 2.5mm; Length of End Connection Pin: 3mm; Contact Material: 黄铜; Operating Temperature Range: -40℃~+105℃; Color: 黑色
K1 = SRD-12VDC-SD-C: 线圈电压:12V;引脚数:5;触点形式:一组转换:1C(单刀双掷-转换);触点容量(电阻负载):-;; LCSC Part Name: 12V继电器 单刀双掷; Supplier Part: C247843; Manufacturer: 松乐; Supplier Footprint: 插件,15.6x19.2mm; JLCPCB Part Class: Extended Part; Datasheet: https://atta.szlcsc.com/upload/public/pdf/source/20180629/C247843_3083DC2E80C67CBA2220A338BABBCB81.PDF; Supplier: LCSC; Coil Voltage: 12V; Coil Type: 非极化-单线圈; Pin Number: 5; Contact Form: 一组转换:1C(单刀双掷-转换); Maximum Switching Current: 15A; Maximum Switching Voltage: 250V@AC; Coil Rated Power: 450mW; Coil Resistance: 320Ω; Operate Time: 10ms; Release Time: 10ms; Contact Resistance: 100mΩ
Q1-Q9 = SS8050_C2150: 晶体管类型:NPN;集射极击穿电压(Vceo):25V;集电极电流(Ic):1.5A;功率(Pd):300mW;直流电流增益(hFE@Ic,Vce):200@100mA,1V;; LCSC Part Name: NPN 25V 1.5A Y1 200-350; Supplier Part: C2150; Manufacturer: CJ(江苏长电/长晶); Supplier Footprint: SOT-23; JLCPCB Part Class: Basic Part; Datasheet: https://atta.szlcsc.com/upload/public/pdf/source/20230322/AEE86F4B043774EFF80CAEA14A37D9E9.pdf; Supplier: LCSC; Transistor Type: NPN; Collector-Emitter Breakdown Voltage (Vceo): 25V; Collector Current (Ic): 1.5A; Power Dissipation (Pd): 300mW; Collector Cut-Off Current (Icbo): 100nA; Collector-Emitter Saturation Voltage (VCE(sat)@Ic,Ib): 500mV@800mA,80mA; DC Current Gain (hFE@Ic,Vce): 200@100mA,1V; Transition Frequency (fT): 100MHz; Operating Temperature: +150℃@(Tj)
R14 = 0603WAF0000T5E: 电阻类型:厚膜电阻;阻值:0Ω;精度:±1%;功率:100mW;; LCSC Part Name: 0Ω ±1% 100mW; Supplier Part: C21189; Manufacturer: UNI-ROYAL(厚声); Supplier Footprint: 0603; JLCPCB Part Class: Basic Part; Datasheet: https://atta.szlcsc.com/upload/public/pdf/source/20200306/C422600_1E6D84923E4A46A82E41ADD87F860B5C.pdf; Supplier: LCSC; Type: 厚膜电阻; Tolerance: ±1%; Power(Watts): 100mW; Overload Voltage (Max): 75V; Operating Temperature Range: -55℃~+155℃
R15 = RC0603FR-07100RL: 电阻类型:厚膜电阻;阻值:100Ω;精度:±1%;功率:100mW;; LCSC Part Name: 100Ω ±1% 100mW; Supplier Part: C105588; Manufacturer: YAGEO(国巨); Supplier Footprint: 0603; JLCPCB Part Class: Extended Part; Datasheet: https://atta.szlcsc.com/upload/public/pdf/source/20170428/1493376742308.pdf; Supplier: LCSC; Type: 厚膜电阻; Tolerance: ±1%; Power(Watts): 100mW; Temperature Coefficient: ±100ppm/℃; Overload Voltage (Max): 75V; Operating Temperature Range: -55℃~+155℃
RELAY1-RELAY9 = SRD-12VDC-SL-C: 线圈电压:12V;引脚数:5;触点形式:一组转换:1C(单刀双掷-转换);触点容量(电阻负载):-;; LCSC Part Name: 12V继电器 单刀双掷 蓝色; Supplier Part: C30431; Manufacturer: 松乐; Supplier Footprint: 插件,15.6x19.2mm; JLCPCB Part Class: Extended Part; Datasheet: https://atta.szlcsc.com/upload/public/pdf/source/20180525/C30431_534ADD4B54993D382CD0EDFAB06D3E7F.pdf; Supplier: LCSC; Coil Voltage: 12V; Coil Type: 非极化-单线圈; Pin Number: 5; Contact Form: 一组转换:1C(单刀双掷-转换); Maximum Switching Current: 15A; Maximum Switching Voltage: 250V@AC; Coil Rated Power: 360mW; Coil Resistance: 400Ω; Operate Time: 10ms; Release Time: 10ms; Contact Resistance: 100mΩ
U21 U27-U37 = X5511FV-01-C30D97-0970: 排数:单排;总孔位数:1P;间距:2.54mm;插孔结构:1x1P;行距:-;安装类型:直插;圆孔/方孔:圆孔;额定电流:-;额定电压:-;插孔方向:顶部;塑高:3mm;触头材质:黄铜;触头镀层:金;工作温度范围:-40℃~+105℃;焊接温度(最大值):260℃;; LCSC Part Name: 间距:2.54mm 1x1P 直插; Supplier Part: C2883469; Manufacturer: XKB Connectivity(中国星坤); Supplier Footprint: 插件,P=2.54mm; JLCPCB Part Class: Extended Part; Datasheet: https://atta.szlcsc.com/upload/public/pdf/source/20211009/43EC1C49F931A7FEC57CD081BD1C4E7E.pdf; Supplier: LCSC; Number of Rows: 单排; Number of Holes: 1P; Pitch: 2.54mm; Holes Structure: 1x1P; Mounting Type: 直插; Circular Hole / Square Hole: 圆孔; Holes Direction: 顶部; Insulation Height: 3mm; Contact Material: 黄铜; Contact Plating: 金; Operating Temperature Range: -40℃~+105℃; Welding Temperature (Max): 260℃
C5 C6 = CL10C220JB8NNNC: 容值:22pF;精度:±5%;额定电压:50V;材质(温度系数):C0G;; LCSC Part Name: 22pF ±5% 50V; Supplier Part: C1653; Manufacturer: SAMSUNG(三星); Supplier Footprint: 0603; JLCPCB Part Class: Basic Part; Datasheet: https://atta.szlcsc.com/upload/public/pdf/source/20160103/1457707687317.pdf; Supplier: LCSC; Tolerance: ±5%; Voltage Rated: 50V; Temperature Coefficient: C0G
C8 = CL10A106KP8NNNC: 容值:10uF;精度:±10%;额定电压:10V;材质(温度系数):X5R;; LCSC Part Name: 10uF ±10% 10V; Supplier Part: C19702; Manufacturer: SAMSUNG(三星); Supplier Footprint: 0603; JLCPCB Part Class: Basic Part; Datasheet: https://atta.szlcsc.com/upload/public/pdf/source/20160103/1457707703378.pdf; Supplier: LCSC; Tolerance: ±10%; Voltage Rated: 10V; Temperature Coefficient: X5R
D2 = SMAJ5.0A_C2925443: 反向截止电压(Vrwm):5V;击穿电压:6.4V;最大钳位电压:9.2V;; LCSC Part Name: 单向TVS 5V截止 43.5A峰值脉冲; Supplier Part: C2925443; Manufacturer: Liown(里阳半导体); Supplier Footprint: SMA(DO-214AC); JLCPCB Part Class: Basic Part; Datasheet: https://atta.szlcsc.com/upload/public/pdf/source/20220105/F191C4E1C1B4B3234C818651946730B4.pdf; Supplier: LCSC; Reverse Stand-Off Voltage (Vrwm): 5V; Breakdown Voltage: 6.4V; Reverse Leakage Current (Ir): 800uA; Peak Pulse Current (Ipp)@10/1000us: 43.5A; Maximum Clamping Voltage: 9.2V; Peak Pulse Power Dissipation (Ppp)@10/1000us: 400W
D3 D13 = 1N5819WS_C191023: 直流反向耐压(Vr):40V;平均整流电流(Io):1A;正向压降(Vf):600mV@1A;; LCSC Part Name: 40V 1A 600mV@1A; Supplier Part: C191023; Manufacturer: Hottech(合科泰); Supplier Footprint: SOD-323; JLCPCB Part Class: Basic Part; Datasheet: https://atta.szlcsc.com/upload/public/pdf/source/20220428/3CB86FD8D28D653594B4E35F9D5AEFD9.pdf; Supplier: LCSC; Reverse Voltage (Vr): 40V; Average Rectified Current (Io): 1A; Forward Voltage (Vf@If): 600mV@1A
U4 = CH340G: 应用功能:收发器;接口协议:USB 2.0;数据速率:2Mbps;; LCSC Part Name: USB转串口芯片 CH340; Supplier Part: C14267; Manufacturer: WCH(南京沁恒); Supplier Footprint: SOP-16; JLCPCB Part Class: Extended Part; Datasheet: https://atta.szlcsc.com/upload/public/pdf/source/20230530/6E401E9554E9F5311886CC8B3F89B62E.pdf; Supplier: LCSC; Applications Function: 收发器; Protocol: USB 2.0; Data Rate: 2Mbps; Supply Voltage: 3.3V；5V
USB1 = USB-B10-BRW: 连接器类型:Type-B;标准:USB 2.0;公母:母座;触点数量:4P;端口数量:1;安装方式:弯插;额定电流 - 电源:1.5A;工作温度范围:-20℃~+70℃;焊接温度(最大值):260℃;; LCSC Part Name: Type-B 母座 弯插; Supplier Part: C720549; Manufacturer: XUNPU(讯普); Supplier Footprint: 插件; JLCPCB Part Class: Extended Part; Datasheet: https://atta.szlcsc.com/upload/public/pdf/source/20200812/C720549_53E9294752E2933874870440E626C579.pdf; Supplier: LCSC; Connector Type: Type-B; Standard: USB 2.0; Gender: 母座; Number of Contacts: 4P; Number of Ports: 1; Mounting Style: 弯插; Current Rating - Power (Max): 1.5A; Operating Temperature Range: -20℃~+70℃; Welding Temperature (Max): 260℃
X2 = X49SD12MSD2SC: 频率:12MHz;频率公差:±20ppm;负载电容:20pF;; LCSC Part Name: 12MHz ±20ppm 20pF HC-49US; Supplier Part: C16369; Manufacturer: YXC(扬兴晶振); Supplier Footprint: HC-49S; JLCPCB Part Class: Extended Part; Datasheet: https://atta.szlcsc.com/upload/public/pdf/source/20210903/A997D130AE99CBB55D9024F9BE6DA174.pdf; Supplier: LCSC; Crystal Type: 49S晶振; Frequency Tolerance: ±20ppm; Frequency Stability: ±30ppm; Load Capacitance: 20pF; Operating Temperature: -20℃~+70℃
J2-J5 = 螺孔_3.1X6MM

## Nets
GND: C1.2 C2.1 C3.1 C4.1 C5.1 C6.1 C7.2 C8.2 C9.2 C10.1 C11.1 C12.2 C13.2 C14.1 C15.1 C16.2 C17.2 C18.2 C19.2 C20.2 C21.2 C22.1 C23.1 C24.1 C25.1 D2.2(A) D3.2(A) DC1.2 DC1.3 J2.1 J3.1 J4.1 J5.1 LED13.1(C) P1.2 Q1.2(E) Q2.2(E) Q3.2(E) Q4.2(E) Q5.2(E) Q6.2(E) Q7.2(E) Q8.2(E) Q9.2(E) R14.1 RF1.1 RF1.2 RF1.3 RF1.4 RF2.1 RF2.2 RF2.3 RF2.4 U1.8(VSSA) U1.23(VSS) U1.47(VSS) U2.8 U2.9 U2.10 U3.4(GND) U4.1(GND) U5.2(AGND) U5.7(DGND) U7.4(V-) U8.4(GND) U27.1 U28.1 U30.1 U32.1 U34.1 U36.1 U39.1 X1.2 X1.4
DAC_OUT: U5.1(VOUT) U7.5(IN B+)
DC_5V: H1.2 P1.1 R15.1
DC_12V: C1.1 C2.2 C3.2 C16.1 C17.1 D1.2(K) D4.1(K) D5.1(K) D6.1(K) D7.1(K) D8.1(K) D9.1(K) D10.1(K) D11.1(K) D12.1(K) RELAY1.1 RELAY2.1 RELAY3.1 RELAY4.1 RELAY5.1 RELAY6.1 RELAY7.1 RELAY8.1 RELAY9.1 U3.1(IN) U8.2(VIN)
DUT_TX: RF2.5 U1.31(PA10/CMP1_OUT/TIM1_CH3/UART1_RX/I2C1_SDA/TIM7_BKIN)
DUT_VCC_DAC: C14.2 H3.1 R4.2 U40.1
DUT_VCC_RLY: H2.1 RELAY9.2 U38.1
GET_DUT_SIGNAL: RF1.5 U1.29(PA8/MCO/TIM1_CH1/CMP2_OUT)
LDO_5V: C4.2 C7.1 C8.1 C12.1 C13.1 C20.1 C21.1 C22.2 C23.2 C24.2 C25.2 D13.2(A) LED1.2(A) LED2.2(A) LED3.2(A) R16.2 U1.1(VDD) U1.9(VDDA) U1.24(VDD) U1.48(VDD) U2.1 U3.3(OUT) U4.16(VCC) U5.8(VDD) U7.8(V+)
LED_BLUE: R2.1 U1.3(PC14)
LED_GREEN: R3.1 U1.4(PC15)
LED_RED: R1.1 U1.2(PC13)
MCO: U1.30(PA9/CMP0_OUT/TIM1_CH2/UART1_TX/I2C1_SCL/MCO/TIM5_BKIN) U2.7
OSC_IN: U1.5(PF0/OSC_IN/I2C0_SDA) X1.1(OSC1)
OSC_OUT: U1.6(PF1/OSC_OUT/I2C0_SCL) X1.3(OSC2)
REF_5V: C10.2 C11.2 C18.1 C19.1 U5.3(REF) U8.6(VOUT)
RLY1_CTRL: R5.1 U1.40(PB4/SPI1_MISO/CMP0_OUT/TIM7_BKIN/ADC_IN11)
RLY2_CTRL: R6.1 U1.38(PA15/SPI1_CS/UART1_RX/UART0_RX/CMP0_P0)
RLY3_CTRL: R7.1 U1.42(PB6/I2C1_SCL/UART1_TX/UART0_TX/I2C0_SCL/TIM6_CH1N/ADC_IN14/CMP2_N)
RLY4_CTRL: R8.1 U1.44(PB2/BEEP1/MCO/CMP1_OUT/ADC_IN9)
RLY5_CTRL: R9.1 U1.39(PB3/SPI1_SCK/ADC_IN10/CMP0_N)
RLY6_CTRL: R10.1 U1.41(PB5/SPI1_MOSI/TIM6_BKIN/ADC_IN13/CMP2_N)
RLY7_CTRL: R11.1 U1.43(PB7/I2C1_SDA/UART1_RX/UART0_RX/I2C0_SDA/CMP2_OUT/TIM7/CJ1N/ADC_IN15)
RLY8_CTRL: R12.1 U1.45(PB8/I2C0_SCL/TIM6_CH1/CMP2_P1)
RLY9_CTRL: R13.1 U1.46(PB9/IR_TXD/I2C0_SDA/TIM7_CH1/CMP2_P2)
RSTN: U1.7(NRST) U2.6
SPI_CS: U1.25(PB12/SPI0_CS/TIM1_BKIN/SPI1_CS) U5.4(CS#)
SPI_MOSI: U1.28(PB15/SPI0_MOSI/TIM1_CH3N/SPI1_MOSI/TIM5_CH1N) U5.6(DIN)
SPI_SCK: U1.26(PB13/SPI0_SCK/TIM1_CH1N/SPI1_SCK/I2C1_SDA) U5.5(SCLK)
SWCLK: U1.37(PA14/SWCLK/UART1_TX/UART0_TX) U2.3
SWDIO: U1.34(PA13/SWDIO/IR_TXD) U2.2
UART_RX: H5.1 U1.13(PA3/UART0_RX/UART1_RX/ADC_IN3/OPA0_P) U2.5 U4.2(TXD)
UART_TX: H4.1 U1.12(PA2/UART0_TX/UART1_TX/TIM5_CH1/ADC_IN2/CMP2_P3/OPA1_OUT) U2.4 U4.3(RXD)
USB_D+: U4.5(UD+) USB1.3(D+)
USB_D-: U4.6(UD-) USB1.2(D-)
$1N739: LED3.1(C) R3.2
$1N740: LED1.1(K) R1.2
$1N744: LED2.1(C) R2.2
$2N132: D1.1(A) DC1.4
$2N1943: C15.2 U8.5(TRIMNR)
$2N2720: LED13.2(A) R16.1
$3N289: D2.1(K) D13.1(K) USB1.1(VBUS)
$3N717: C5.2 U4.7(XI) X2.1(OSC1)
$3N720: C6.2 U4.8(XO) X2.2(OSC2)
$3N945: C9.1 U4.4(V3)
$3N993: D3.1(K) USB1.4(GND) USB1.5(GND) USB1.6(GND)
$5N715: R4.1 U7.6(IN B-) U7.7(OUT B)
$6N2399: LED4.1(C) Q1.1(B)
$6N2435: LED4.2(A) R5.2
$6N2519: LED5.1(C) Q2.1(B)
$6N2555: LED5.2(A) R6.2
$6N3018: LED6.2(A) R7.2
$6N3020: LED6.1(C) Q3.1(B)
$6N3329: LED7.2(A) R8.2
$6N3331: LED7.1(C) Q4.1(B)
$6N3966: LED8.2(A) R9.2
$6N3968: LED8.1(C) Q5.1(B)
$6N4277: LED9.2(A) R10.2
$6N4279: LED9.1(C) Q6.1(B)
$6N4588: LED10.2(A) R11.2
$6N4590: LED10.1(C) Q7.1(B)
$6N4862: LED11.1(C) Q8.1(B)
$6N4864: LED11.2(A) R12.2
$6N7937: LED12.1(C) Q9.1(B)
$6N7938: LED12.2(A) R13.2
$6N8376: R14.2 RELAY8.2
$6N8481: D8.2(A) Q5.3(C) RELAY5.4
$6N8494: D9.2(A) Q6.3(C) RELAY6.4
$6N8516: D10.2(A) Q7.3(C) RELAY7.4
$6N8536: D7.2(A) Q4.3(C) RELAY4.4
$6N8545: D6.2(A) Q3.3(C) RELAY3.4
$6N8554: D5.2(A) Q2.3(C) RELAY2.4
$6N8572: D4.2(A) Q1.3(C) RELAY1.4
$6N8587: RELAY2.2 U21.1
$6N8589: RELAY3.2 U29.1
$6N8591: RELAY4.2 U31.1
$6N8593: RELAY5.2 U33.1
$6N8597: RELAY6.2 U35.1
$6N8599: RELAY7.2 U37.1
$6N9026: RELAY1.2 RELAY2.5 RELAY3.5 RELAY4.5 RELAY5.5 RELAY6.5 RELAY7.5 RELAY8.5 RELAY9.5
$6N11153: H1.1 R15.2 RELAY1.5
$6N13186: D12.2(A) Q9.3(C) RELAY9.4
$6N13204: D11.2(A) Q8.3(C) RELAY8.4

Not connected (* = marked no-connect by the designer): K1 1 2 3 4 5; RELAY1 3*; RELAY2 3*; RELAY3 3*; RELAY4 3*; RELAY5 3*; RELAY6 3*; RELAY7 3*; RELAY8 3*; RELAY9 3*; U1 10(PA0/ADC_IN0/VREF+/CMP1_P/OPA1_P)* 11(PA1/ADC_IN1/CMP1_N/OPA1_N)* 14(PA4/SPI0_CS/UART1_TX/UART0_TX)* 15(PA5/SPI0_SCK/UART1_RX/UART0_RX/ADC_IN5/CMP0_P3/OPA0_OUT)* 16(PA6/SPI0_MISO/TIM1_BKIN/TIM6/CH1/ADC_IN6)* 17(PA7/SPI0_MOSI/TIM1_CJ1N/ADC_ETR/TIM7_CH1/ADC_IN7)* 18(PB0/TIM1_CH2N/ADC_IN12)* 19(PB1/IR_TXD/TIM1_3N/ADC_IN8)* 20(PF2/TIM5_CH1)* 21(PB10/SPI1_SCK/I2C0_SCL/I2C1_SCL/TIM6_CH1/CMP_P1)* 22(PB11/I2C0_SDA/I2C1_SDA/TIM7_CH1/CMP0_P2)* 27(PB14/SPI0_MISO/TIM1_CH2N/SPI1_MISO/TIM5_CH1)* 32(PA11/I2C1_SCL/TIM1_CH4/I2C0_SCL)* 33(PA12/I2C1_SDA/TIM1_CH4N/I2C0_SDA/TIM1_ETR)* 35(PF6/I2C1_SCL/I2C0_SCL)* 36(PF7/I2C1_SDA/I2C0_SDA)*; U4 9(CTS#)* 10(DSR#)* 11(RI#)* 12(DCD#)* 13(DTR#)* 14(RTS#)* 15(R232)*; U7 1(OUT A)* 2(IN A-)* 3(IN A+)*; U8 1(DNC)* 3(TEMP)* 7(NC)* 8(DNC)*

## Notes on the sheets
sheet 1
- CTRL_MCU
- CRYSTAL
- CTRL_MCU
- DEBUG
- SMA->DUT
- LED
sheet 2
- DC_12V
- LDO_5V
- REF_5V
- DC_5V
- POWER_LED
- POWER
sheet 3
- USB
- USB->UART
- UART
sheet 4
- 螺孔
sheet 5
- DUT跳线排针
- 测试环
- DAC_SET
- DAC_OUT
- DAC
sheet 6
- 测试环
- DUT跳线排针
- 继电器1,9断开
  继电器2，3，4，5，6，7，8闭合
  电容放电
- 测试环
- RLY
- 限流电阻
- 跳线帽连接可不使用限流电阻
